# EAGLE design Controller (EAGLE 9.6.2)

## Sheet 1 of 6: Power Supply
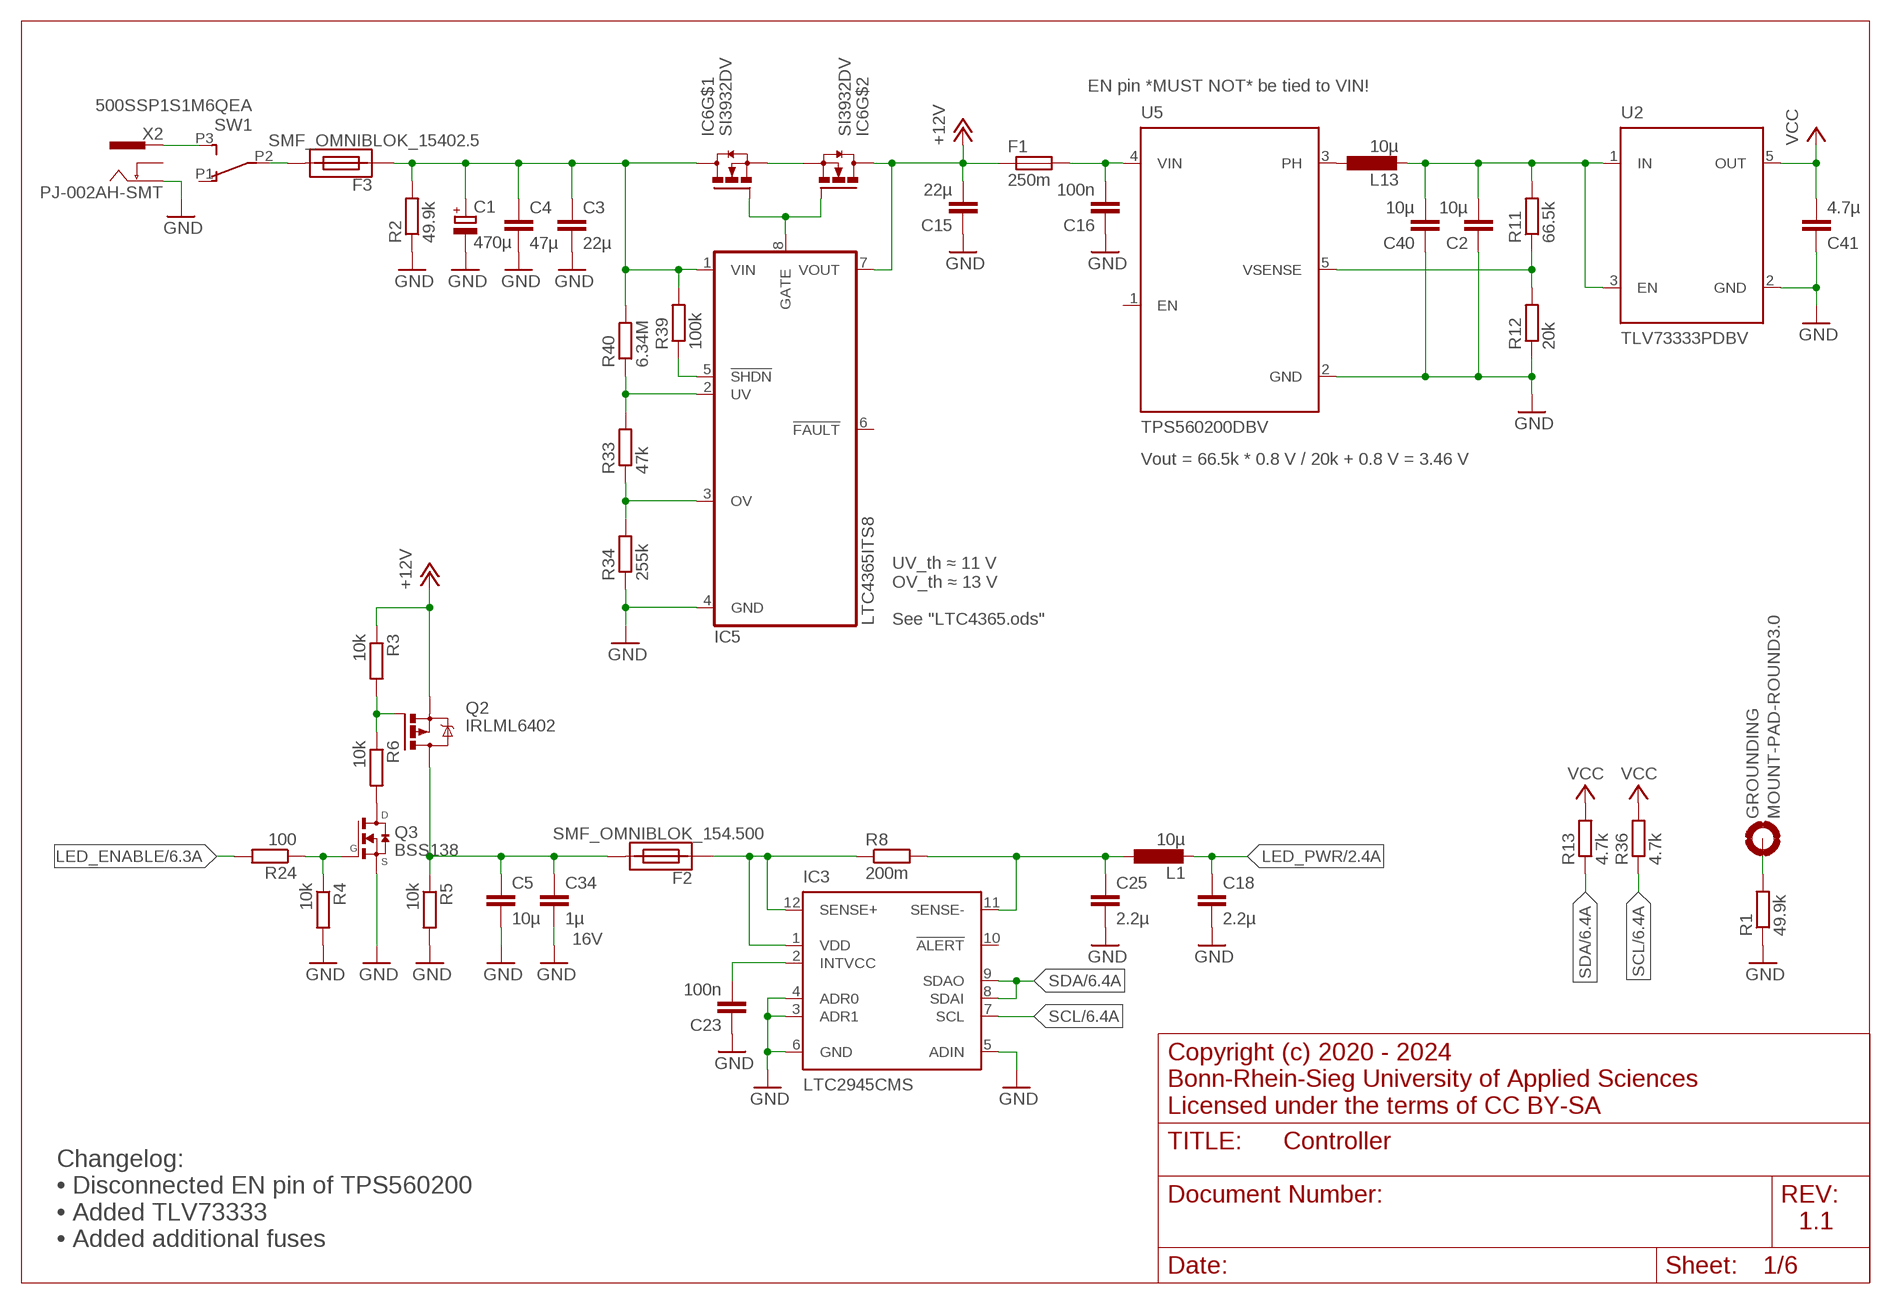
[diagram p0: schematic, sheet 1]

### Parts
C1  470µ  CPOL-EUUD-10X10  [UD-10X10_NICHICON]
C2  10µ  C-EUC0805  [C0805]
C3  22µ  C-EUC1206  [C1206]
C4  47µ  C-EUC1206  [C1206]
C5  10µ  C-EUC0805  [C0805]
C15  22µ  C-EUC0805  [C0805]
C16  100n  C-EUC0603  [C0603]
C18  2.2µ  C-EUC0805  [C0805]
C23  100n  C-EUC0603  [C0603]
C25  2.2µ  C-EUC0805  [C0805]
C34  1µ  C-EUC0805  [C0805]
C40  10µ  C-EUC0805  [C0805]
C41  4.7µ  C-EUC0805  [C0805]
F1  250m  FUSE0603  [R0603]
F2  SMF_OMNIBLOK_154.500  [NANO2_SMF_FUSEBLOCK]
F3  SMF_OMNIBLOK_15402.5  [NANO2_SMF_FUSEBLOCK]
GROUNDING  MOUNT-PAD-ROUND3.0  [3,0-PAD]
IC3  LTC2945CMS  [MSOP12]
IC5  LTC4365ITS8  [TSOT-23-8]
IC6  SI3932DV  [TSOT-23-6]
L1  10µ  LQH44PH100MPR  [SMD]
L13  10µ  VLS3012ET-100M  [2SMD]
Q2  IRLML6402  [MICRO3]
Q3  BSS138  [SOT23]
R1  49.9k  R-EU_R0805  [R0805]
R2  49.9k  R-EU_R1206  [R1206]
R3  10k  R-EU_R0603  [R0603]
R4  10k  R-EU_R0603  [R0603]
R5  10k  R-EU_R1206  [R1206]
R6  10k  R-EU_R0603  [R0603]
R8  200m  R-EU_R2512  [R2512]
R11  66.5k  R-EU_R0603  [R0603]
R12  20k  R-EU_R0603  [R0603]
R13  4.7k  R-EU_R0603  [R0603]
R24  100  R-EU_R0603  [R0603]
R33  47k  R-EU_R0603  [R0603]
R34  255k  R-EU_R0603  [R0603]
R36  4.7k  R-EU_R0603  [R0603]
R39  100k  R-EU_R0603  [R0603]
R40  6.34M  R-EU_R0603  [R0603]
SW1  500SSP1S1M6QEA  [500SSP1S1M6QEA]
U2  TLV73333PDBV  [SOT-23]
U5  TPS560200DBV  [SOT-23]
X2  PJ-002AH-SMT  [PJ-002AH-SMT]

### Nets
+12V [Power]: C15.2 F1.1 IC5.7(VOUT) IC6.4(D) Q2.2(S) R3.1 ; also sheet 6
GND: C1.- C2.1 C3.2 C4.2 C5.2 C15.1 C16.1 C18.2 C23.1 C25.2 C34.2 C40.1 C41.1 IC3.3(ADR1) IC3.4(ADR0) IC3.5(ADIN) IC3.6(GND) IC5.4(GND) Q3.2(S) R1.1 R2.1 R4.2 R5.2 R12.1 R34.1 U2.2(GND) U5.2(GND) X2.2(OUT) ; also sheet 2,3,4,5,6
LED_ENABLE: R24.2 ; also sheet 6
LED_PWR [Power]: C18.1 L1.2 ; also sheet 2,3,4,5,6
N$1: GROUNDING.B3,0(MOUNT) R1.2
N$2: C2.2 C40.2 L13.P$2 R11.2 U2.1(IN) U2.3(EN)
N$3: C25.1 IC3.11(SENSE-) L1.1 R8.2
N$4 [Power]: C16.2 F1.2 U5.4(VIN)
N$5: Q2.1(G) R3.2 R6.1
N$6: Q3.1(G) R4.1 R24.1
N$7: Q3.3(D) R6.2
N$8: C5.1 C34.1 F2.2 Q2.3(D) R5.1
N$11 [Power]: SW1.P3 X2.1-1(IN) X2.1-2(IN)
N$12: L13.P$1 U5.3(PH)
N$14 [Power]: C1.+ C3.1 C4.1 F3.1 IC5.1(VIN) IC6.6(D) R2.2 R39.2 R40.2
N$15: R11.1 R12.2 U5.5(VSENSE)
N$20: F2.1 IC3.1(VDD) IC3.12(SENSE+) R8.1
N$57: F3.2 SW1.P2
N$65: IC5.8(GATE) IC6.1(G) IC6.3(G)
N$66: IC5.3(OV) R33.1 R34.2
N$67: IC5.2(UV) R33.2 R40.1
N$68: IC5.5(!SHDN) R39.1
N$69: IC6.2(S) IC6.5(S)
N$72: C23.2 IC3.2(INTVCC)
SCL: IC3.7(SCL) R36.1 ; also sheet 6
SDA: IC3.8(SDAI) IC3.9(SDAO) R13.1 ; also sheet 6
VCC: C41.2 R13.2 R36.2 U2.5(OUT) ; also sheet 6
Unconnected: IC3.10(!ALERT!) IC5.6(!FAULT) SW1.P1 U5.1(EN) X2.3(CONTACT)

### Notes on the sheet
- EN pin *MUST NOT* be tied to VIN!
- Vout = 66.5k * 0.8 V / 20k + 0.8 V = 3.46 V
- UV_th ≈ 11 V
  OV_th ≈ 13 V
  
  See "LTC4365.ods"
- Copyright (c) 2020 - 2024
  Bonn-Rhein-Sieg University of Applied Sciences
  Licensed under the terms of CC BY-SA
- 1.1
- Changelog:
  • Disconnected EN pin of TPS560200
  • Added TLV73333
  • Added additional fuses

## Sheet 2 of 6: LED Drivers 1
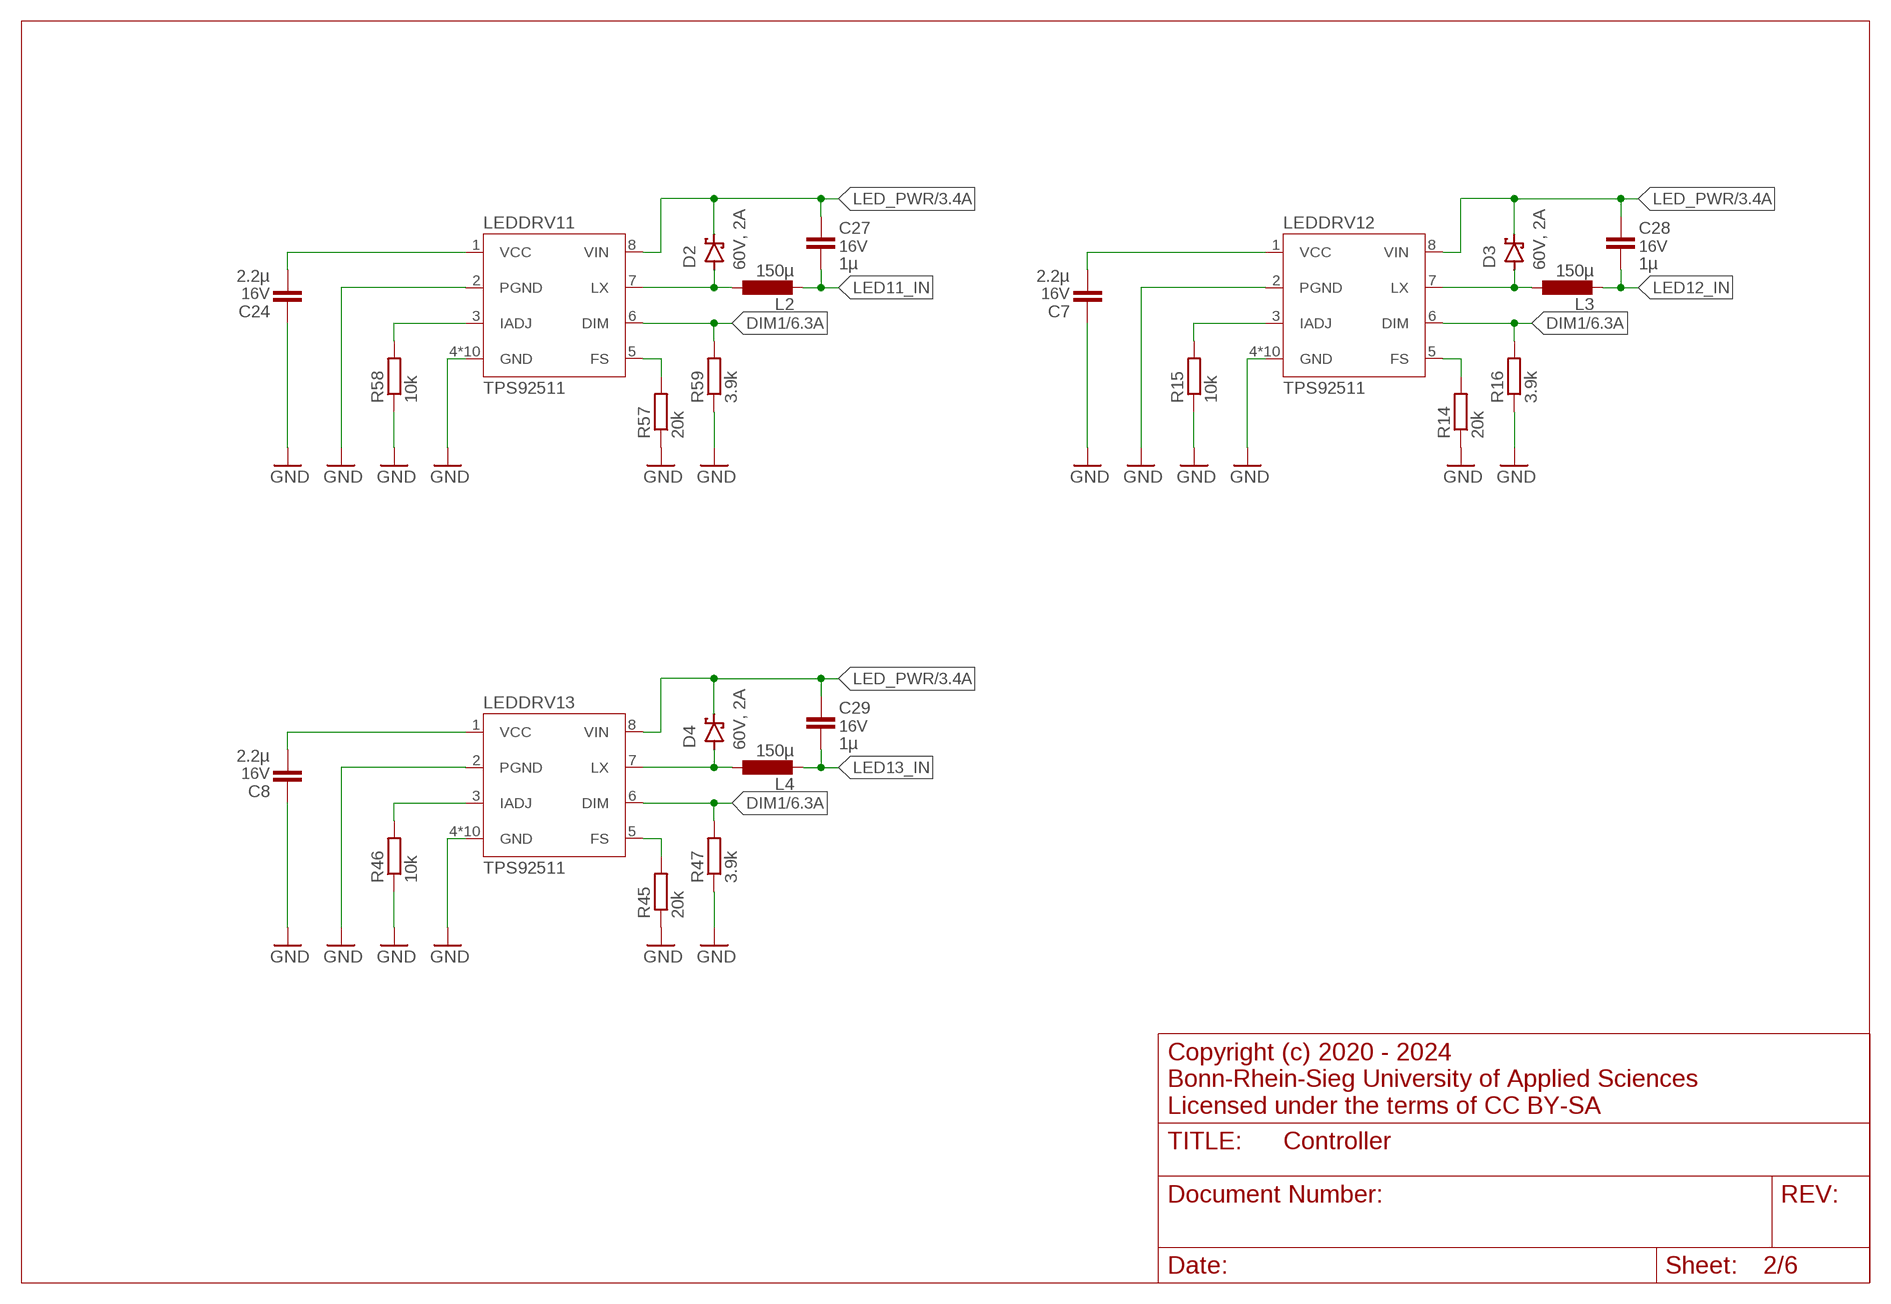
[diagram p1: schematic, sheet 2]

### Parts
C7  2.2µ  C-EUC0603  [C0603]
C8  2.2µ  C-EUC0603  [C0603]
C24  2.2µ  C-EUC0603  [C0603]
C27  1µ  C-EUC0805  [C0805]
C28  1µ  C-EUC0805  [C0805]
C29  1µ  C-EUC0805  [C0805]
D2  60V, 2A  SCHOTTKY-DIODESMD  [SMB]
D3  60V, 2A  SCHOTTKY-DIODESMD  [SMB]
D4  60V, 2A  SCHOTTKY-DIODESMD  [SMB]
L2  150µ  LQH44PH151MPR  [SMD]
L3  150µ  LQH44PH151MPR  [SMD]
L4  150µ  LQH44PH151MPR  [SMD]
LEDDRV11  TPS92511  [SOIC-8-EP]
LEDDRV12  TPS92511  [SOIC-8-EP]
LEDDRV13  TPS92511  [SOIC-8-EP]
R14  20k  R-EU_R0603  [R0603]
R15  10k  R-EU_R0603  [R0603]
R16  3.9k  R-EU_R0603  [R0603]
R45  20k  R-EU_R0603  [R0603]
R46  10k  R-EU_R0603  [R0603]
R47  3.9k  R-EU_R0603  [R0603]
R57  20k  R-EU_R0603  [R0603]
R58  10k  R-EU_R0603  [R0603]
R59  3.9k  R-EU_R0603  [R0603]

### Nets
DIM1: LEDDRV11.6(DIM) LEDDRV12.6(DIM) LEDDRV13.6(DIM) R16.2 R47.2 R59.2 ; also sheet 6
GND: C7.1 C8.1 C24.1 LEDDRV11.2(PGND) LEDDRV11.4(GND) LEDDRV11.EPAD(GND) LEDDRV11.P$1(GND) LEDDRV11.P$2(GND) LEDDRV11.P$3(GND) LEDDRV11.P$4(GND) LEDDRV11.P$5(GND) LEDDRV11.P$6(GND) LEDDRV11.P$7(GND) LEDDRV11.P$8(GND) LEDDRV12.2(PGND) LEDDRV12.4(GND) LEDDRV12.EPAD(GND) LEDDRV12.P$1(GND) LEDDRV12.P$2(GND) LEDDRV12.P$3(GND) LEDDRV12.P$4(GND) LEDDRV12.P$5(GND) LEDDRV12.P$6(GND) LEDDRV12.P$7(GND) LEDDRV12.P$8(GND) LEDDRV13.2(PGND) LEDDRV13.4(GND) LEDDRV13.EPAD(GND) LEDDRV13.P$1(GND) LEDDRV13.P$2(GND) LEDDRV13.P$3(GND) LEDDRV13.P$4(GND) LEDDRV13.P$5(GND) LEDDRV13.P$6(GND) LEDDRV13.P$7(GND) LEDDRV13.P$8(GND) R14.1 R15.1 R16.1 R45.1 R46.1 R47.1 R57.1 R58.1 R59.1 ; also sheet 1,3,4,5,6
LED11_IN: C27.2 L2.2 ; also sheet 6
LED12_IN: C28.2 L3.2 ; also sheet 6
LED13_IN: C29.2 L4.2 ; also sheet 6
LED_PWR [Power]: C27.1 C28.1 C29.1 D2.C D3.C D4.C LEDDRV11.8(VIN) LEDDRV12.8(VIN) LEDDRV13.8(VIN) ; also sheet 1,3,4,5,6
N$21: D3.A L3.1 LEDDRV12.7(LX)
N$22: LEDDRV12.5(FS) R14.2
N$23: LEDDRV12.3(IADJ) R15.2
N$24: C7.2 LEDDRV12.1(VCC)
N$25: D4.A L4.1 LEDDRV13.7(LX)
N$26: LEDDRV13.5(FS) R45.2
N$27: LEDDRV13.3(IADJ) R46.2
N$28: C8.2 LEDDRV13.1(VCC)
N$74: D2.A L2.1 LEDDRV11.7(LX)
N$75: LEDDRV11.5(FS) R57.2
N$76: LEDDRV11.3(IADJ) R58.2
N$77: C24.2 LEDDRV11.1(VCC)

### Notes on the sheet
- Copyright (c) 2020 - 2024
  Bonn-Rhein-Sieg University of Applied Sciences
  Licensed under the terms of CC BY-SA

## Sheet 3 of 6: LED Drivers 2
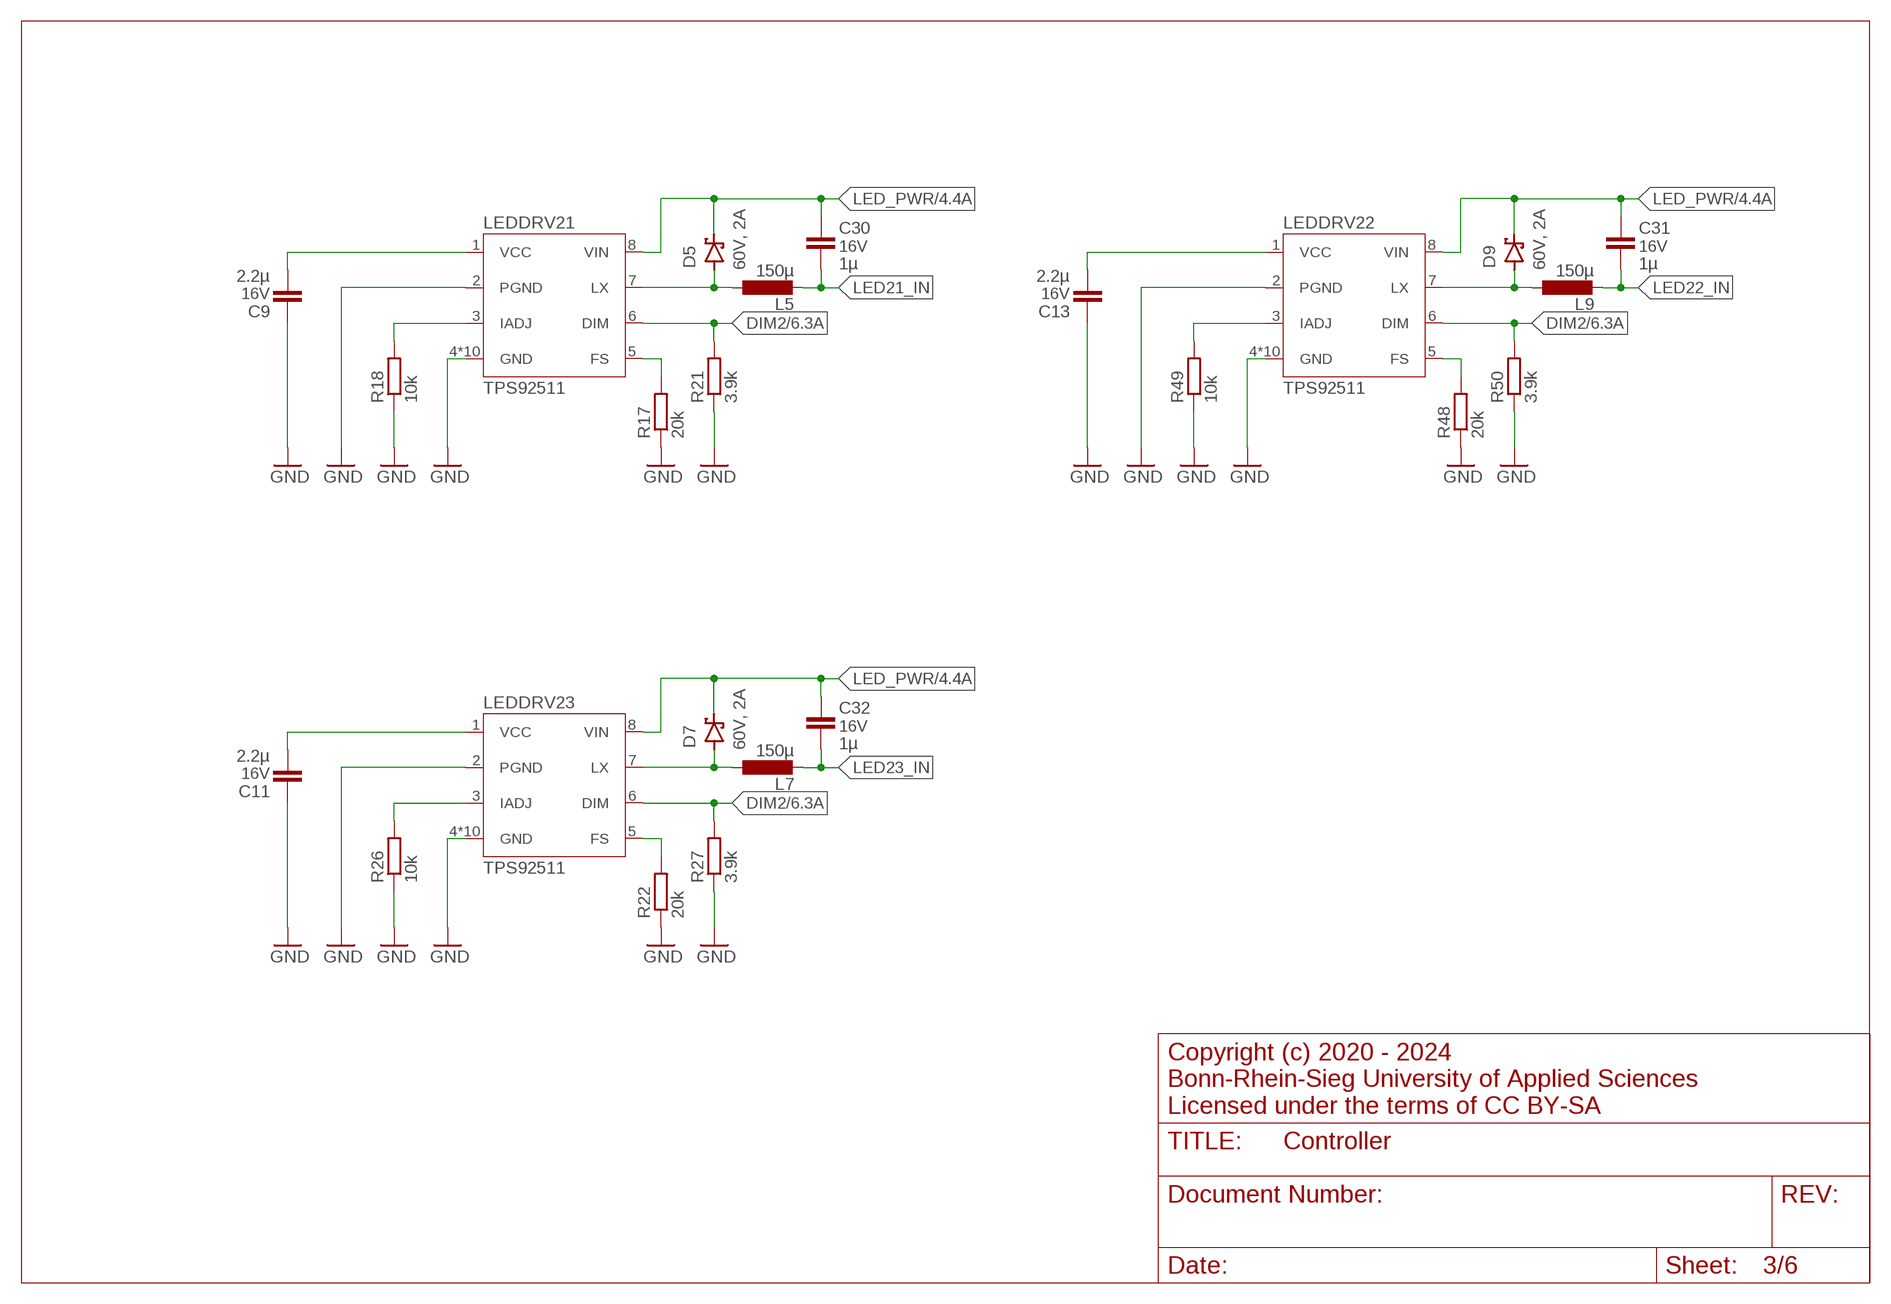
[diagram p2: schematic, sheet 3]

### Parts
C9  2.2µ  C-EUC0603  [C0603]
C11  2.2µ  C-EUC0603  [C0603]
C13  2.2µ  C-EUC0603  [C0603]
C30  1µ  C-EUC0805  [C0805]
C31  1µ  C-EUC0805  [C0805]
C32  1µ  C-EUC0805  [C0805]
D5  60V, 2A  SCHOTTKY-DIODESMD  [SMB]
D7  60V, 2A  SCHOTTKY-DIODESMD  [SMB]
D9  60V, 2A  SCHOTTKY-DIODESMD  [SMB]
L5  150µ  LQH44PH151MPR  [SMD]
L7  150µ  LQH44PH151MPR  [SMD]
L9  150µ  LQH44PH151MPR  [SMD]
LEDDRV21  TPS92511  [SOIC-8-EP]
LEDDRV22  TPS92511  [SOIC-8-EP]
LEDDRV23  TPS92511  [SOIC-8-EP]
R17  20k  R-EU_R0603  [R0603]
R18  10k  R-EU_R0603  [R0603]
R21  3.9k  R-EU_R0603  [R0603]
R22  20k  R-EU_R0603  [R0603]
R26  10k  R-EU_R0603  [R0603]
R27  3.9k  R-EU_R0603  [R0603]
R48  20k  R-EU_R0603  [R0603]
R49  10k  R-EU_R0603  [R0603]
R50  3.9k  R-EU_R0603  [R0603]

### Nets
DIM2: LEDDRV21.6(DIM) LEDDRV22.6(DIM) LEDDRV23.6(DIM) R21.2 R27.2 R50.2 ; also sheet 6
GND: C9.1 C11.1 C13.1 LEDDRV21.2(PGND) LEDDRV21.4(GND) LEDDRV21.EPAD(GND) LEDDRV21.P$1(GND) LEDDRV21.P$2(GND) LEDDRV21.P$3(GND) LEDDRV21.P$4(GND) LEDDRV21.P$5(GND) LEDDRV21.P$6(GND) LEDDRV21.P$7(GND) LEDDRV21.P$8(GND) LEDDRV22.2(PGND) LEDDRV22.4(GND) LEDDRV22.EPAD(GND) LEDDRV22.P$1(GND) LEDDRV22.P$2(GND) LEDDRV22.P$3(GND) LEDDRV22.P$4(GND) LEDDRV22.P$5(GND) LEDDRV22.P$6(GND) LEDDRV22.P$7(GND) LEDDRV22.P$8(GND) LEDDRV23.2(PGND) LEDDRV23.4(GND) LEDDRV23.EPAD(GND) LEDDRV23.P$1(GND) LEDDRV23.P$2(GND) LEDDRV23.P$3(GND) LEDDRV23.P$4(GND) LEDDRV23.P$5(GND) LEDDRV23.P$6(GND) LEDDRV23.P$7(GND) LEDDRV23.P$8(GND) R17.1 R18.1 R21.1 R22.1 R26.1 R27.1 R48.1 R49.1 R50.1 ; also sheet 1,2,4,5,6
LED21_IN: C30.2 L5.2 ; also sheet 6
LED22_IN: C31.2 L9.2 ; also sheet 6
LED23_IN: C32.2 L7.2 ; also sheet 6
LED_PWR [Power]: C30.1 C31.1 C32.1 D5.C D7.C D9.C LEDDRV21.8(VIN) LEDDRV22.8(VIN) LEDDRV23.8(VIN) ; also sheet 1,2,4,5,6
N$29: D5.A L5.1 LEDDRV21.7(LX)
N$30: LEDDRV21.5(FS) R17.2
N$31: LEDDRV21.3(IADJ) R18.2
N$32: C9.2 LEDDRV21.1(VCC)
N$37: D7.A L7.1 LEDDRV23.7(LX)
N$38: LEDDRV23.5(FS) R22.2
N$39: LEDDRV23.3(IADJ) R26.2
N$40: C11.2 LEDDRV23.1(VCC)
N$45: D9.A L9.1 LEDDRV22.7(LX)
N$46: LEDDRV22.5(FS) R48.2
N$47: LEDDRV22.3(IADJ) R49.2
N$48: C13.2 LEDDRV22.1(VCC)

### Notes on the sheet
- Copyright (c) 2020 - 2024
  Bonn-Rhein-Sieg University of Applied Sciences
  Licensed under the terms of CC BY-SA

## Sheet 4 of 6: LED Drivers 3
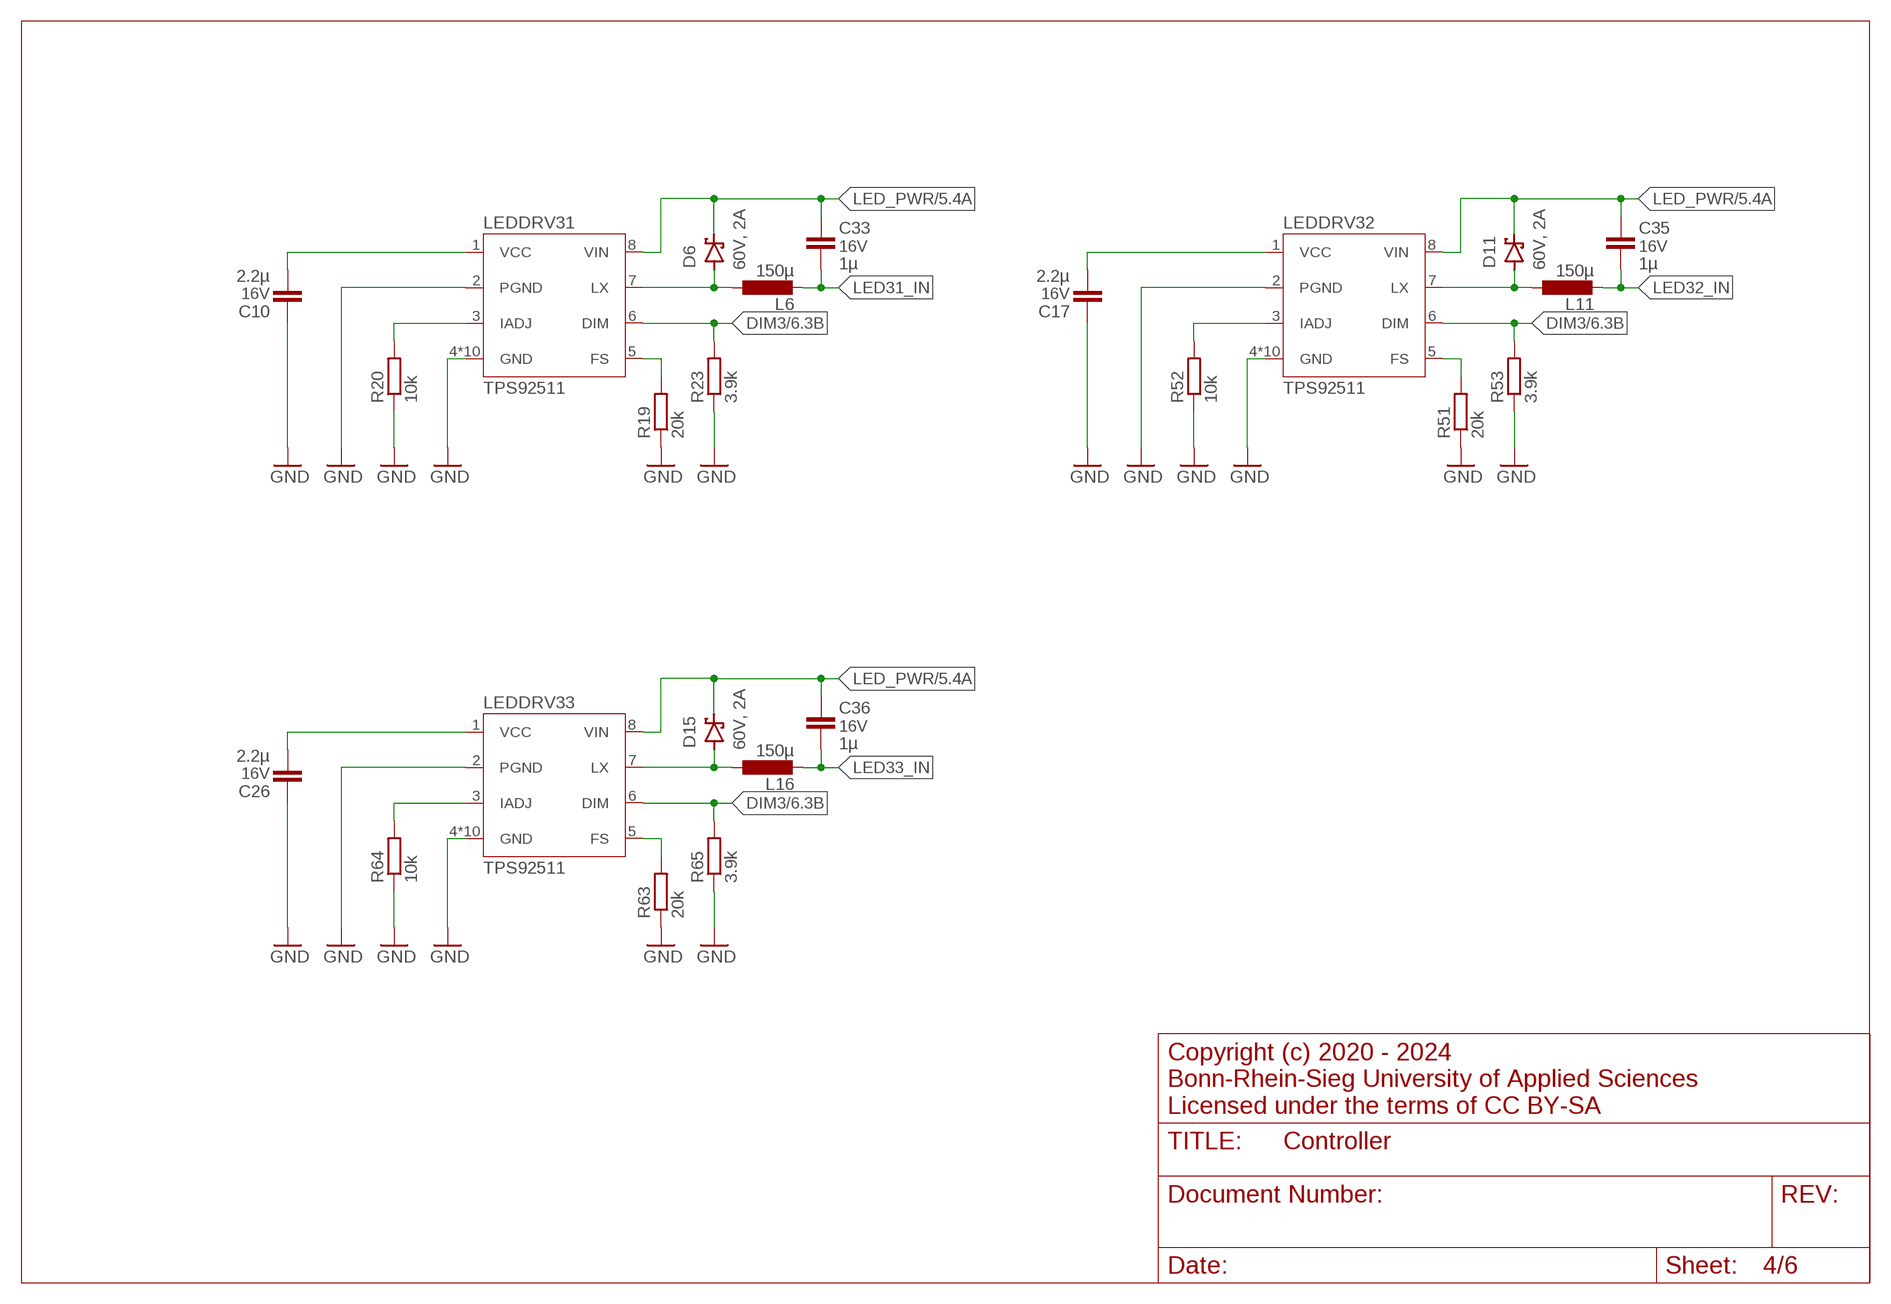
[diagram p3: schematic, sheet 4]

### Parts
C10  2.2µ  C-EUC0603  [C0603]
C17  2.2µ  C-EUC0603  [C0603]
C26  2.2µ  C-EUC0603  [C0603]
C33  1µ  C-EUC0805  [C0805]
C35  1µ  C-EUC0805  [C0805]
C36  1µ  C-EUC0805  [C0805]
D6  60V, 2A  SCHOTTKY-DIODESMD  [SMB]
D11  60V, 2A  SCHOTTKY-DIODESMD  [SMB]
D15  60V, 2A  SCHOTTKY-DIODESMD  [SMB]
L6  150µ  LQH44PH151MPR  [SMD]
L11  150µ  LQH44PH151MPR  [SMD]
L16  150µ  LQH44PH151MPR  [SMD]
LEDDRV31  TPS92511  [SOIC-8-EP]
LEDDRV32  TPS92511  [SOIC-8-EP]
LEDDRV33  TPS92511  [SOIC-8-EP]
R19  20k  R-EU_R0603  [R0603]
R20  10k  R-EU_R0603  [R0603]
R23  3.9k  R-EU_R0603  [R0603]
R51  20k  R-EU_R0603  [R0603]
R52  10k  R-EU_R0603  [R0603]
R53  3.9k  R-EU_R0603  [R0603]
R63  20k  R-EU_R0603  [R0603]
R64  10k  R-EU_R0603  [R0603]
R65  3.9k  R-EU_R0603  [R0603]

### Nets
DIM3: LEDDRV31.6(DIM) LEDDRV32.6(DIM) LEDDRV33.6(DIM) R23.2 R53.2 R65.2 ; also sheet 6
GND: C10.1 C17.1 C26.1 LEDDRV31.2(PGND) LEDDRV31.4(GND) LEDDRV31.EPAD(GND) LEDDRV31.P$1(GND) LEDDRV31.P$2(GND) LEDDRV31.P$3(GND) LEDDRV31.P$4(GND) LEDDRV31.P$5(GND) LEDDRV31.P$6(GND) LEDDRV31.P$7(GND) LEDDRV31.P$8(GND) LEDDRV32.2(PGND) LEDDRV32.4(GND) LEDDRV32.EPAD(GND) LEDDRV32.P$1(GND) LEDDRV32.P$2(GND) LEDDRV32.P$3(GND) LEDDRV32.P$4(GND) LEDDRV32.P$5(GND) LEDDRV32.P$6(GND) LEDDRV32.P$7(GND) LEDDRV32.P$8(GND) LEDDRV33.2(PGND) LEDDRV33.4(GND) LEDDRV33.EPAD(GND) LEDDRV33.P$1(GND) LEDDRV33.P$2(GND) LEDDRV33.P$3(GND) LEDDRV33.P$4(GND) LEDDRV33.P$5(GND) LEDDRV33.P$6(GND) LEDDRV33.P$7(GND) LEDDRV33.P$8(GND) R19.1 R20.1 R23.1 R51.1 R52.1 R53.1 R63.1 R64.1 R65.1 ; also sheet 1,2,3,5,6
LED31_IN: C33.2 L6.2 ; also sheet 6
LED32_IN: C35.2 L11.2 ; also sheet 6
LED33_IN: C36.2 L16.2 ; also sheet 6
LED_PWR [Power]: C33.1 C35.1 C36.1 D6.C D11.C D15.C LEDDRV31.8(VIN) LEDDRV32.8(VIN) LEDDRV33.8(VIN) ; also sheet 1,2,3,5,6
N$33: D6.A L6.1 LEDDRV31.7(LX)
N$34: LEDDRV31.5(FS) R19.2
N$35: LEDDRV31.3(IADJ) R20.2
N$36: C10.2 LEDDRV31.1(VCC)
N$53: D11.A L11.1 LEDDRV32.7(LX)
N$54: LEDDRV32.5(FS) R51.2
N$55: LEDDRV32.3(IADJ) R52.2
N$56: C17.2 LEDDRV32.1(VCC)
N$82: D15.A L16.1 LEDDRV33.7(LX)
N$83: LEDDRV33.5(FS) R63.2
N$84: LEDDRV33.3(IADJ) R64.2
N$85: C26.2 LEDDRV33.1(VCC)

### Notes on the sheet
- Copyright (c) 2020 - 2024
  Bonn-Rhein-Sieg University of Applied Sciences
  Licensed under the terms of CC BY-SA

## Sheet 5 of 6: LED Drivers 4
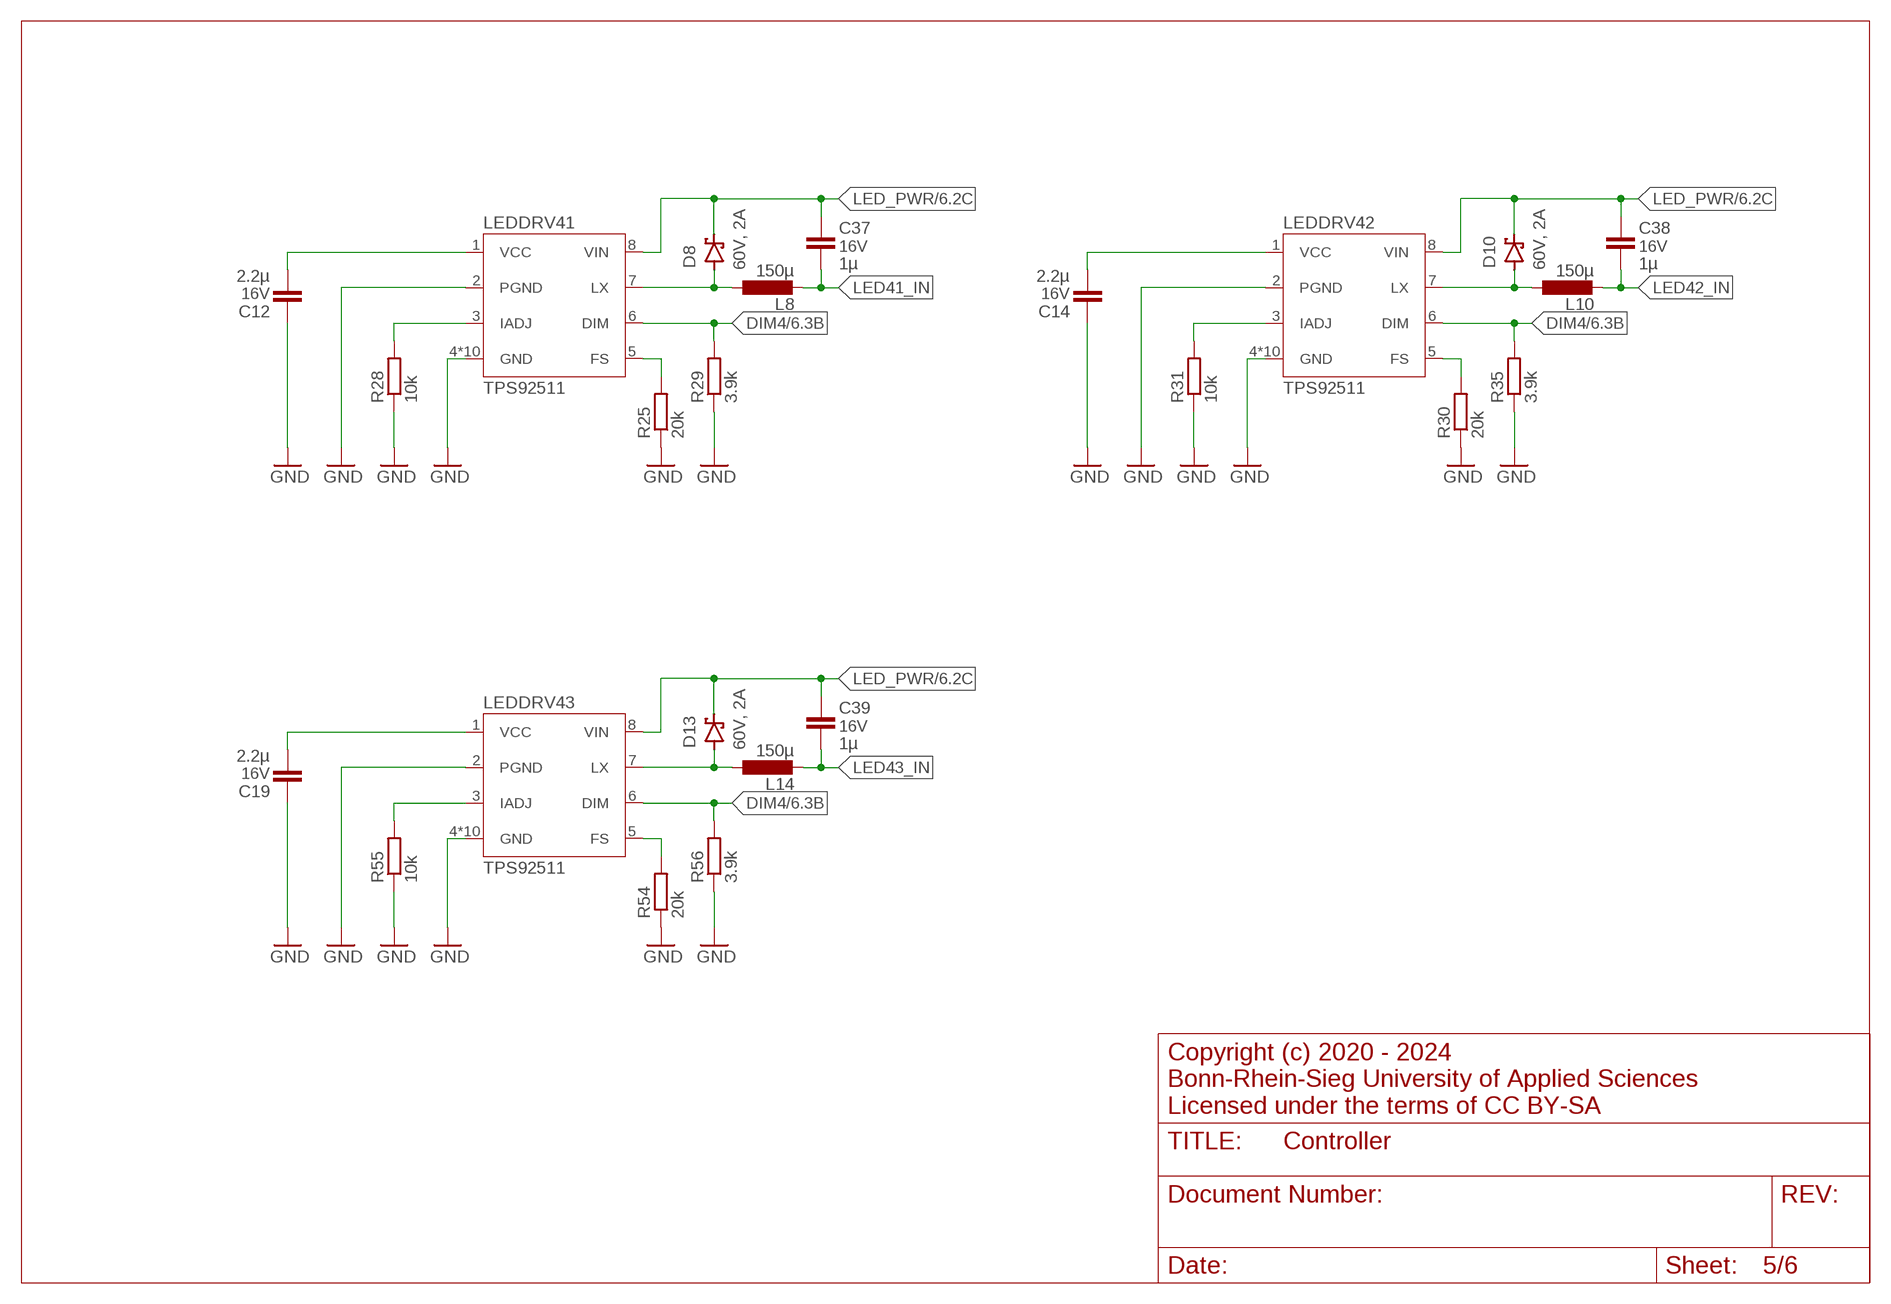
[diagram p4: schematic, sheet 5]

### Parts
C12  2.2µ  C-EUC0603  [C0603]
C14  2.2µ  C-EUC0603  [C0603]
C19  2.2µ  C-EUC0603  [C0603]
C37  1µ  C-EUC0805  [C0805]
C38  1µ  C-EUC0805  [C0805]
C39  1µ  C-EUC0805  [C0805]
D8  60V, 2A  SCHOTTKY-DIODESMD  [SMB]
D10  60V, 2A  SCHOTTKY-DIODESMD  [SMB]
D13  60V, 2A  SCHOTTKY-DIODESMD  [SMB]
L8  150µ  LQH44PH151MPR  [SMD]
L10  150µ  LQH44PH151MPR  [SMD]
L14  150µ  LQH44PH151MPR  [SMD]
LEDDRV41  TPS92511  [SOIC-8-EP]
LEDDRV42  TPS92511  [SOIC-8-EP]
LEDDRV43  TPS92511  [SOIC-8-EP]
R25  20k  R-EU_R0603  [R0603]
R28  10k  R-EU_R0603  [R0603]
R29  3.9k  R-EU_R0603  [R0603]
R30  20k  R-EU_R0603  [R0603]
R31  10k  R-EU_R0603  [R0603]
R35  3.9k  R-EU_R0603  [R0603]
R54  20k  R-EU_R0603  [R0603]
R55  10k  R-EU_R0603  [R0603]
R56  3.9k  R-EU_R0603  [R0603]

### Nets
DIM4: LEDDRV41.6(DIM) LEDDRV42.6(DIM) LEDDRV43.6(DIM) R29.2 R35.2 R56.2 ; also sheet 6
GND: C12.1 C14.1 C19.1 LEDDRV41.2(PGND) LEDDRV41.4(GND) LEDDRV41.EPAD(GND) LEDDRV41.P$1(GND) LEDDRV41.P$2(GND) LEDDRV41.P$3(GND) LEDDRV41.P$4(GND) LEDDRV41.P$5(GND) LEDDRV41.P$6(GND) LEDDRV41.P$7(GND) LEDDRV41.P$8(GND) LEDDRV42.2(PGND) LEDDRV42.4(GND) LEDDRV42.EPAD(GND) LEDDRV42.P$1(GND) LEDDRV42.P$2(GND) LEDDRV42.P$3(GND) LEDDRV42.P$4(GND) LEDDRV42.P$5(GND) LEDDRV42.P$6(GND) LEDDRV42.P$7(GND) LEDDRV42.P$8(GND) LEDDRV43.2(PGND) LEDDRV43.4(GND) LEDDRV43.EPAD(GND) LEDDRV43.P$1(GND) LEDDRV43.P$2(GND) LEDDRV43.P$3(GND) LEDDRV43.P$4(GND) LEDDRV43.P$5(GND) LEDDRV43.P$6(GND) LEDDRV43.P$7(GND) LEDDRV43.P$8(GND) R25.1 R28.1 R29.1 R30.1 R31.1 R35.1 R54.1 R55.1 R56.1 ; also sheet 1,2,3,4,6
LED41_IN: C37.2 L8.2 ; also sheet 6
LED42_IN: C38.2 L10.2 ; also sheet 6
LED43_IN: C39.2 L14.2 ; also sheet 6
LED_PWR [Power]: C37.1 C38.1 C39.1 D8.C D10.C D13.C LEDDRV41.8(VIN) LEDDRV42.8(VIN) LEDDRV43.8(VIN) ; also sheet 1,2,3,4,6
N$41: D8.A L8.1 LEDDRV41.7(LX)
N$42: LEDDRV41.5(FS) R25.2
N$43: LEDDRV41.3(IADJ) R28.2
N$44: C12.2 LEDDRV41.1(VCC)
N$49: D10.A L10.1 LEDDRV42.7(LX)
N$50: LEDDRV42.5(FS) R30.2
N$51: LEDDRV42.3(IADJ) R31.2
N$52: C14.2 LEDDRV42.1(VCC)
N$61: D13.A L14.1 LEDDRV43.7(LX)
N$62: LEDDRV43.5(FS) R54.2
N$63: LEDDRV43.3(IADJ) R55.2
N$64: C19.2 LEDDRV43.1(VCC)

### Notes on the sheet
- Copyright (c) 2020 - 2024
  Bonn-Rhein-Sieg University of Applied Sciences
  Licensed under the terms of CC BY-SA

## Sheet 6 of 6: µController & Connectors
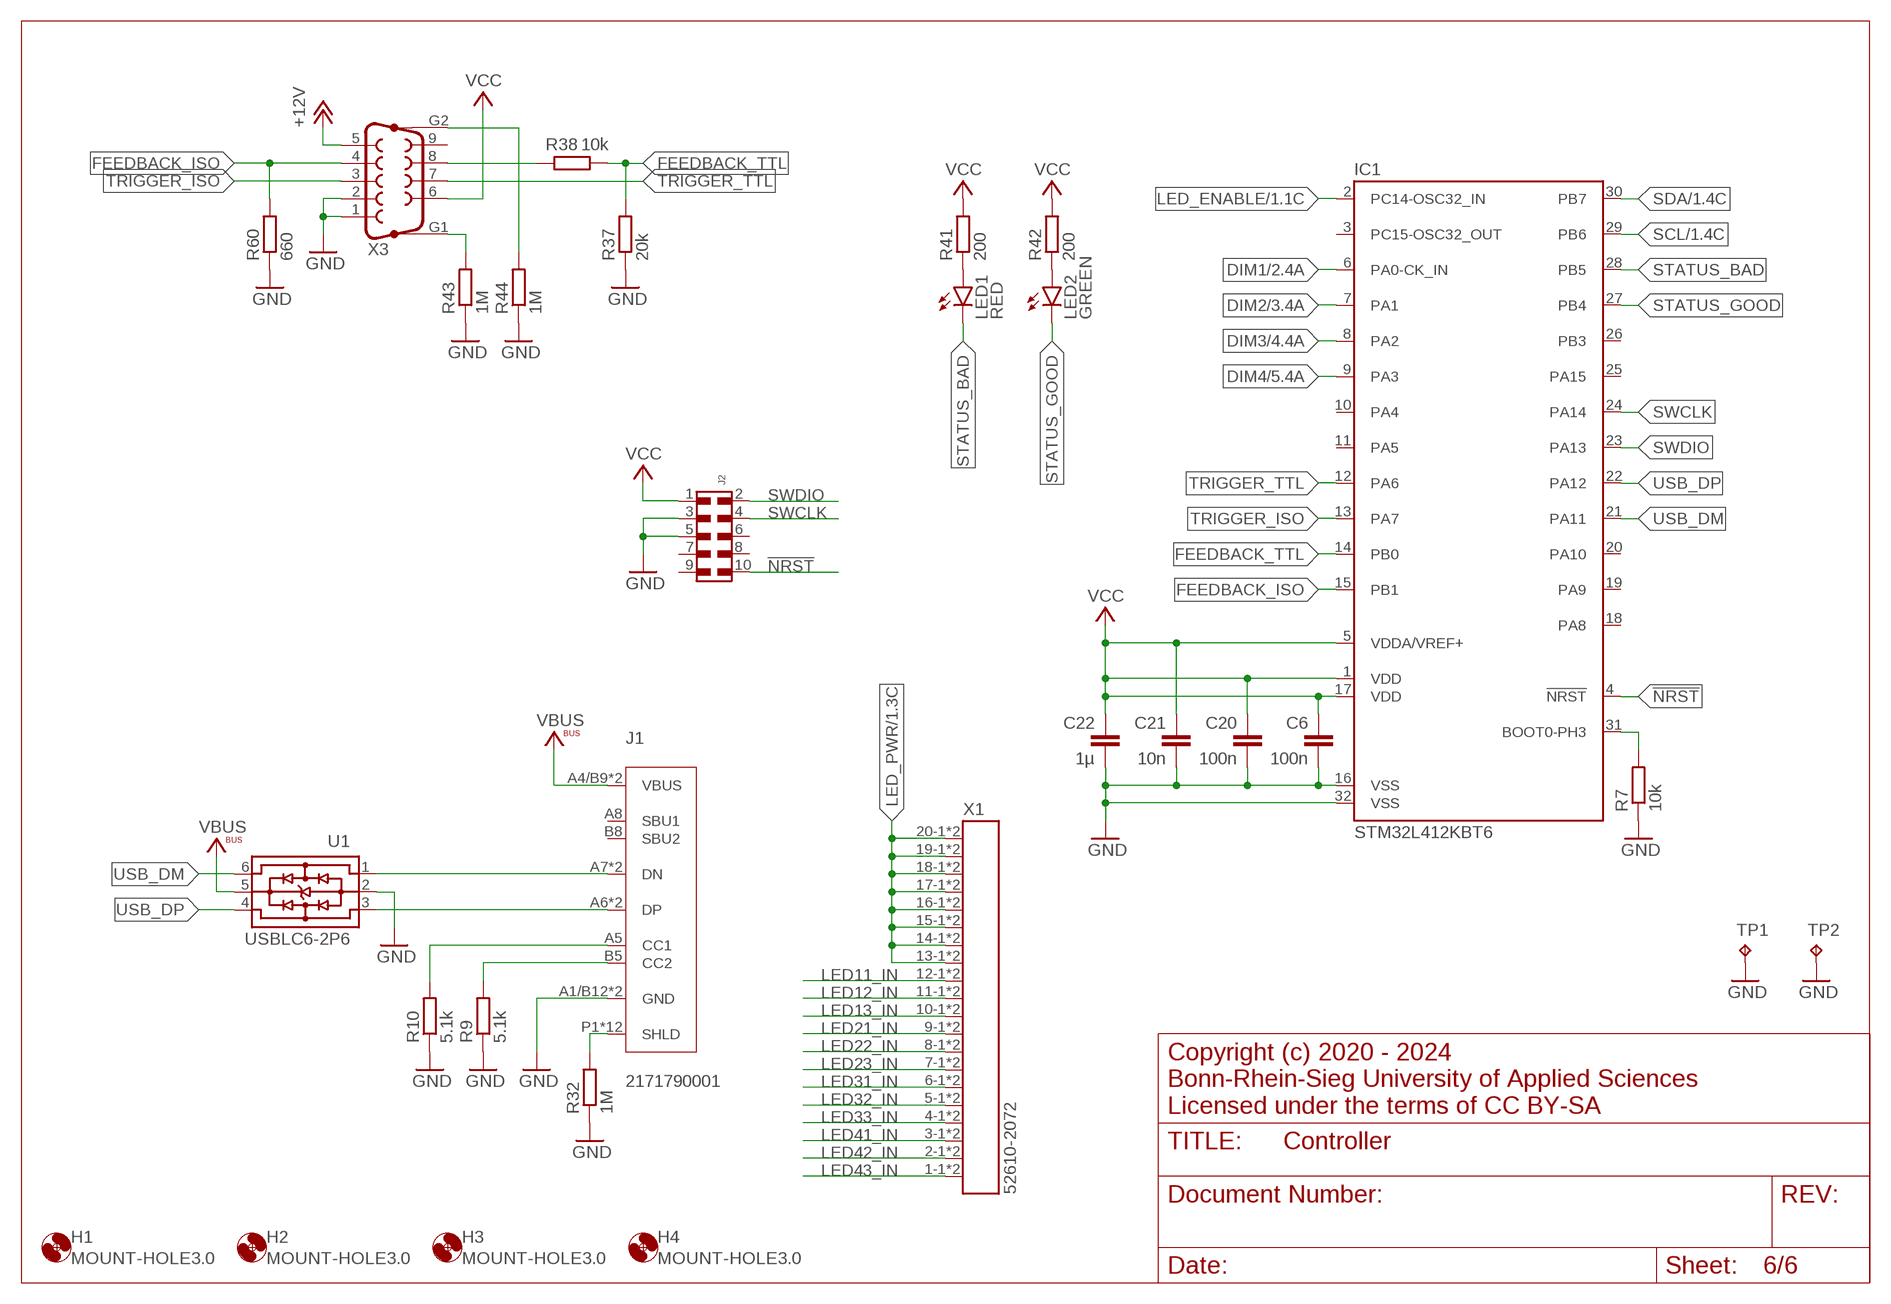
[diagram p5: schematic, sheet 6]

### Parts
C6  100n  C-EUC0603  [C0603]
C20  100n  C-EUC0603  [C0603]
C21  10n  C-EUC0603  [C0603]
C22  1µ  C-EUC0603  [C0603]
H1  MOUNT-HOLE3.0  [3,0]
H2  MOUNT-HOLE3.0  [3,0]
H3  MOUNT-HOLE3.0  [3,0]
H4  MOUNT-HOLE3.0  [3,0]
IC1  STM32L412KBT6  [LQFP32]
J1  2171790001  [2171790001_MOL]
J2  6210XX21021_62101021021  [62101021021]
LED1  RED  LED3MM  [LED3MM]
LED2  GREEN  LED3MM  [LED3MM]
R7  10k  R-EU_R0603  [R0603]
R9  5.1k  R-EU_R0603  [R0603]
R10  5.1k  R-EU_R0603  [R0603]
R32  1M  R-EU_R0603  [R0603]
R37  20k  R-EU_R0603  [R0603]
R38  10k  R-EU_R0603  [R0603]
R41  200  R-EU_R0603  [R0603]
R42  200  R-EU_R0603  [R0603]
R43  1M  R-EU_R0603  [R0603]
R44  1M  R-EU_R0603  [R0603]
R60  660  R-EU_R0603  [R0603]
TP1  TP3.8X2.03  [3.8X2.03]
TP2  TP3.8X2.03  [3.8X2.03]
U1  USBLC6-2P6  [SOT-666]
X1  52610-2072  [52610-2072]
X3  F09HP  [F09HP]

### Nets
!NRST: IC1.4(!NRST) J2.10
+12V [Power]: X3.5 ; also sheet 1
DIM1: IC1.6(PA0-CK_IN) ; also sheet 2
DIM2: IC1.7(PA1) ; also sheet 3
DIM3: IC1.8(PA2) ; also sheet 4
DIM4: IC1.9(PA3) ; also sheet 5
FEEDBACK_ISO: IC1.15(PB1) R60.2 X3.4
FEEDBACK_TTL: IC1.14(PB0) R37.2 R38.1
GND: C6.2 C20.2 C21.2 C22.2 IC1.16(VSS) IC1.32(VSS) J1.A1/B12(GND) J1.B1/A12(GND) J2.3 J2.5 R7.1 R9.1 R10.1 R32.1 R37.1 R43.1 R44.1 R60.1 TP1.TP TP2.TP U1.2 X3.1 X3.2 ; also sheet 1,2,3,4,5
LED11_IN: X1.12-1 X1.12-2 ; also sheet 2
LED12_IN: X1.11-1 X1.11-2 ; also sheet 2
LED13_IN: X1.10-1 X1.10-2 ; also sheet 2
LED21_IN: X1.9-1 X1.9-2 ; also sheet 3
LED22_IN: X1.8-1 X1.8-2 ; also sheet 3
LED23_IN: X1.7-1 X1.7-2 ; also sheet 3
LED31_IN: X1.6-1 X1.6-2 ; also sheet 4
LED32_IN: X1.5-1 X1.5-2 ; also sheet 4
LED33_IN: X1.4-1 X1.4-2 ; also sheet 4
LED41_IN: X1.3-1 X1.3-2 ; also sheet 5
LED42_IN: X1.2-1 X1.2-2 ; also sheet 5
LED43_IN: X1.1-1 X1.1-2 ; also sheet 5
LED_ENABLE: IC1.2(PC14-OSC32_IN) ; also sheet 1
LED_PWR [Power]: X1.13-1 X1.13-2 X1.14-1 X1.14-2 X1.15-1 X1.15-2 X1.16-1 X1.16-2 X1.17-1 X1.17-2 X1.18-1 X1.18-2 X1.19-1 X1.19-2 X1.20-1 X1.20-2 ; also sheet 1,2,3,4,5
N$9: IC1.31(BOOT0-PH3) R7.2
N$10: R43.2 X3.G1
N$13: J1.A7(DN) J1.B7(DN) U1.1
N$16: J1.A6(DP) J1.B6(DP) U1.3
N$17: J1.B5(CC2) R9.2
N$18: J1.A5(CC1) R10.2
N$19: J1.P1(SHLD) J1.P2(SHLD) J1.P3(SHLD) J1.P4(SHLD) J1.S1(SHLD) J1.S2(SHLD) J1.S3(SHLD) J1.S4(SHLD) J1.S5(SHLD) J1.S6(SHLD) J1.S7(SHLD) J1.S8(SHLD) R32.2
N$58: R38.2 X3.8
N$70: LED1.A R41.1
N$71: LED2.A R42.1
N$73: R44.2 X3.G2
SCL: IC1.29(PB6) ; also sheet 1
SDA: IC1.30(PB7) ; also sheet 1
STATUS_BAD: IC1.28(PB5) LED1.K(C)
STATUS_GOOD: IC1.27(PB4) LED2.K(C)
SWCLK: IC1.24(PA14) J2.4
SWDIO: IC1.23(PA13) J2.2
TRIGGER_ISO: IC1.13(PA7) X3.3
TRIGGER_TTL: IC1.12(PA6) X3.7
USB_DM: IC1.21(PA11) U1.6
USB_DP: IC1.22(PA12) U1.4
VBUS: J1.A4/B9(VBUS) J1.B4/A9(VBUS) U1.5
VCC: C6.1 C20.1 C21.1 C22.1 IC1.1(VDD) IC1.5(VDDA/VREF+) IC1.17(VDD) J2.1 R41.2 R42.2 X3.6 ; also sheet 1
Unconnected: IC1.3(PC15-OSC32_OUT) IC1.10(PA4) IC1.11(PA5) IC1.18(PA8) IC1.19(PA9) IC1.20(PA10) IC1.25(PA15) IC1.26(PB3) J1.A8(SBU1) J1.B8(SBU2) J2.6 J2.7 J2.8 J2.9 X3.9

### Notes on the sheet
- Copyright (c) 2020 - 2024
  Bonn-Rhein-Sieg University of Applied Sciences
  Licensed under the terms of CC BY-SA

## Library data of the parts
C1 = rcl:CPOL-EU: POLARIZED CAPACITOR, European symbol; SPICEPREFIX: C
C2 C5 C15 C16 C18 C23 C25 C40 C41 = rcl:C-EU: CAPACITOR, European symbol
C3 C4 C6 C20-C22 = rcl:C-EU: CAPACITOR, European symbol; SPICEPREFIX: C
C7-C14 C17 C19 C24 C26-C33 C35-C39 = rcl:C-EU: CAPACITOR, European symbol; RATING: 16V; SPICEPREFIX: C
C34 = rcl:C-EU: CAPACITOR, European symbol; RATING: 16V
D2-D11 D13 D15 = diode:SCHOTTKY-DIODE: Schottky Diode; FBS_ID: 1101
F1 = Fuse0603:FUSE: Surface mount fuse
F2 = Littelfuse:SMF_OMNIBLOK_154: Littlefuse SMF OMNI-BLOK (R) Fuse Holder with Installed Fuse (NANO2 SMF): Series 154; FBS_ID: 963
F3 = Littelfuse:SMF_OMNIBLOK_154: Littlefuse SMF OMNI-BLOK (R) Fuse Holder with Installed Fuse (NANO2 SMF): Series 154
GROUNDING = holes:MOUNT-PAD-ROUND: MOUNTING PAD, round
H1-H4 = holes:MOUNT-HOLE: MOUNTING HOLE with drill center marker
IC1 = STM32:STM32L412K*?: Ultra-low-power ARM Cortex-M4 32-bit MCU+FPU, 100DMIPS, up to 128KB Flash, 40KB SRAM, analog, ext. SMPS
IC3 = LTC2945:LTC2945: Wide Range I2C Power Monitor
IC5 = LTC4365:LTC4365: UV, OV and Reverse Supply Protection Controller
IC6 = Si3932:SI3932DV: Dual N-Channel 30 V (D-S) MOSFET
J1 = USB-C:2171790001; COPYRIGHT: Copyright (C) 2021 Ultra Librarian. All rights reserved.; DIGI-KEY_PART_NUMBER_1: 900-2171790001TR-ND; DIGI-KEY_PART_NUMBER_2: 900-2171790001CT-ND; DIGI-KEY_PART_NUMBER_3: 900-2171790001DKR-ND; MANUFACTURER_PART_NUMBER: 2171790001; MFR_NAME: Molex Connector Corporation
J2 = WR-PHD:6210XX21021_62101021021: WR-PHD 1.27 mm SMT Dual Pin Header, H=3.80 mm ARTICLE PROPERTIES: Pins:4;​ 8;​ 10;​ 14;​ 16;​ 20;​ 28;​ 40;​ 44;​ 50 KIND PROPERTIES: Pitch：1.27 mm Quality Class:3 as per CECC 75 301-802 Rows：Dual Gender：Pin Header Type：Straight MATERIAL PROPERTIES: Insulator Material :PA9T Insulator Flammability Rating:UL94 V-0 Contact Material:Copper Alloy Contact Plating:Gold Contact Type:Stamped GENERAL INFORMATION Operating Temperature:-40 up to +105 °C Compliance:Lead free / RoHS ELECTRICAL PROPERTIES: Rated Current:1 A;​ max. IR1:1 A Withstanding Voltage:500 V (AC) Contact Resistance:20 mΩ RISO:1000 MΩ CERTIFICATION UL Approval:E323964 PACKAGING PROPERTIES Packaging:Tube Packaging Unit:228;​ 114;​ 91;​ 65;​ 57;​ 45;​ 32;​ 23;​ 20;​ 18 <https://katalog.we-online.com/media/images/v2/o33195v209%20Family_WR-PDH_621xxx21021.jpg> Details see: https://katalog.we-online.com/en/em/PHD_1_27_SMT_DUAL_PIN_HEADER_6210XX21021 Updated by Yingchun,Shan 2019-10-25 2019 (C) Würth Elektronik; DATASHEET-URL: https://katalog.we-online.com/em/datasheet/62101021021.pdf; GENDER: Pin Header; IR: 1A; MATES: WR-PHD 1.27mm Dual Socket Header/SMT Dual Socket Header,H=4.5mm/SMT Dual Socket Header,H=4.5mm(Reel); PACKAGING: Tube; PART-NUMBER: 62101021021; PINS: 10; ROWS: Dual; TYPE: Straight
L1-L11 L14 L16 = LQH44PH:LQH44PH: Chip Coils/Inductors
L13 = VLS3012E:VLS3012E?-*: Inductors for power circuits
LED1 LED2 = led:LED: LED OSRAM: - CHIPLED LG R971, LG N971, LY N971, LG Q971, LY Q971, LO R971, LY R971 LH N974, LH R974 LS Q976, LO Q976, LY Q976 LO Q996 - Hyper CHIPLED LW Q18S LB Q993, LB Q99A, LB R99A - SideLED LS A670, LO A670, LY A670, LG A670, LP A670 LB A673, LV A673, LT A673, LW A673 LH A674 LY A675 LS A676, LA A676, LO A676, LY A676, LW A676 LS A679, LY A679, LG A679 - Hyper Micro SIDELED® LS Y876, LA Y876, LO Y876, LY Y876 LT Y87S - SmartLED LW L88C, LW L88S LB L89C, LB L89S, LG L890 LS L89K, LO L89K, LY L89K LS L896, LA L896, LO L896, LY L896 - TOPLED LS T670, LO T670, LY T670, LG T670, LP T670 LSG T670, LSP T670, LSY T670, LOP T670, LYG T670 LG T671, LOG T671, LSG T671 LB T673, LV T673, LT T673, LW T673 LH T674 LS T676, LA T676, LO T676, LY T676, LB T676, LH T676, LSB T676, LW T676 LB T67C, LV T67C, LT T67C, LS T67K, LO T67K, LY T67K, LW E67C LS E67B, LA E67B, LO E67B, LY E67B, LB E67C, LV E67C, LT E67C LW T67C LS T679, LY T679, LG T679 LS T770, LO T770, LY T770, LG T770, LP T770 LB T773, LV T773, LT T773, LW T773 LH T774 LS E675, LA E675, LY E675, LS T675 LS T776, LA T776, LO T776, LY T776, LB T776 LHGB T686 LT T68C, LB T68C - Hyper Mini TOPLED® LB M676 - Mini TOPLED Santana® LG M470 LS M47K, LO M47K, LY M47K Source: http://www.osram.convergy.de LUXEON: - LUMILED® LXK2-PW12-R00, LXK2-PW12-S00, LXK2-PW14-U00, LXK2-PW14-V00 LXK2-PM12-R00, LXK2-PM12-S00, LXK2-PM14-U00 LXK2-PE12-Q00, LXK2-PE12-R00, LXK2-PE12-S00, LXK2-PE14-T00, LXK2-PE14-U00 LXK2-PB12-K00, LXK2-PB12-L00, LXK2-PB12-M00, LXK2-PB14-N00, LXK2-PB14-P00, LXK2-PB14-Q00 LXK2-PR12-L00, LXK2-PR12-M00, LXK2-PR14-Q00, LXK2-PR14-R00 LXK2-PD12-Q00, LXK2-PD12-R00, LXK2-PD12-S00 LXK2-PH12-R00, LXK2-PH12-S00 LXK2-PL12-P00, LXK2-PL12-Q00, LXK2-PL12-R00 Source: www.luxeon.com KINGBRIGHT: KA-3528ASYC Source: www.kingbright.com
LEDDRV11-LEDDRV13 LEDDRV21-LEDDRV23 LEDDRV31-LEDDRV33 LEDDRV41-LEDDRV43 = TPS92511:TPS92511: 500-mA, 65-V Common Anode Constant Current Buck LED Driver Without External Current Sensing Resistor
Q2 = IRLML6402:IRLML6402: HEXFET P-Channel Power MOSFET
Q3 = transistor-fet:BSS138*: Power MOSFET
R1 R2 R7-R10 R13-R23 R25-R32 R35-R38 R41-R60 R63-R65 = rcl:R-EU_: RESISTOR, European symbol; SPICEPREFIX: R
R3-R6 R11 R12 R24 R33 R34 R39 R40 = rcl:R-EU_: RESISTOR, European symbol
SW1 = 500SSP1S1M6QEA:500SSP1S1M6QEA
TP1 TP2 = Testpoints:TP: KEYSTONE SURFACE MOUNT TEST POINTS
U1 = USBLC6-2:USBLC6-2: Very low capacitance ESD protection
U2 = TLV733P:TLV733*P?: TLV733P Capacitor-Free, 300-mA, Low-Dropout Regulator in 1-mm × 1-mm X2SON Package
U5 = TPS560200:TPS560200: 4.5-V to 17-V Input, 500-mA Synchronous Step-Down Converter With Advanced Eco-Mode
X1 = Molex 52610-XX72:52610-2072
X2 = PJ-002AH:PJ-002AH
X3 = con-subd:F09HP: SUB-D; OC_FARNELL: unknown; OC_NEWARK: unknown

## Net classes
2 Power: clearance 0.203 mm

## Board
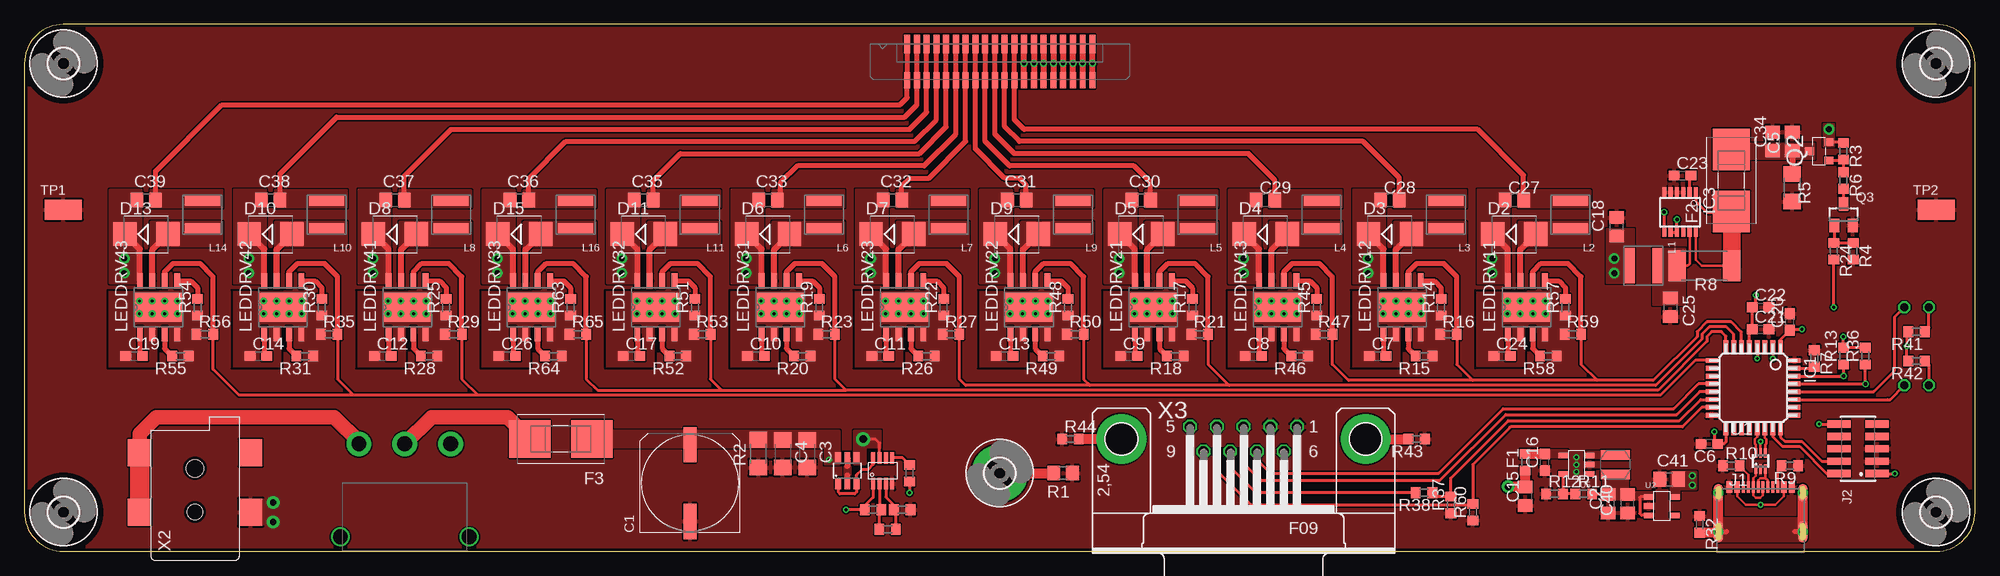
[diagram p6: board, top side]
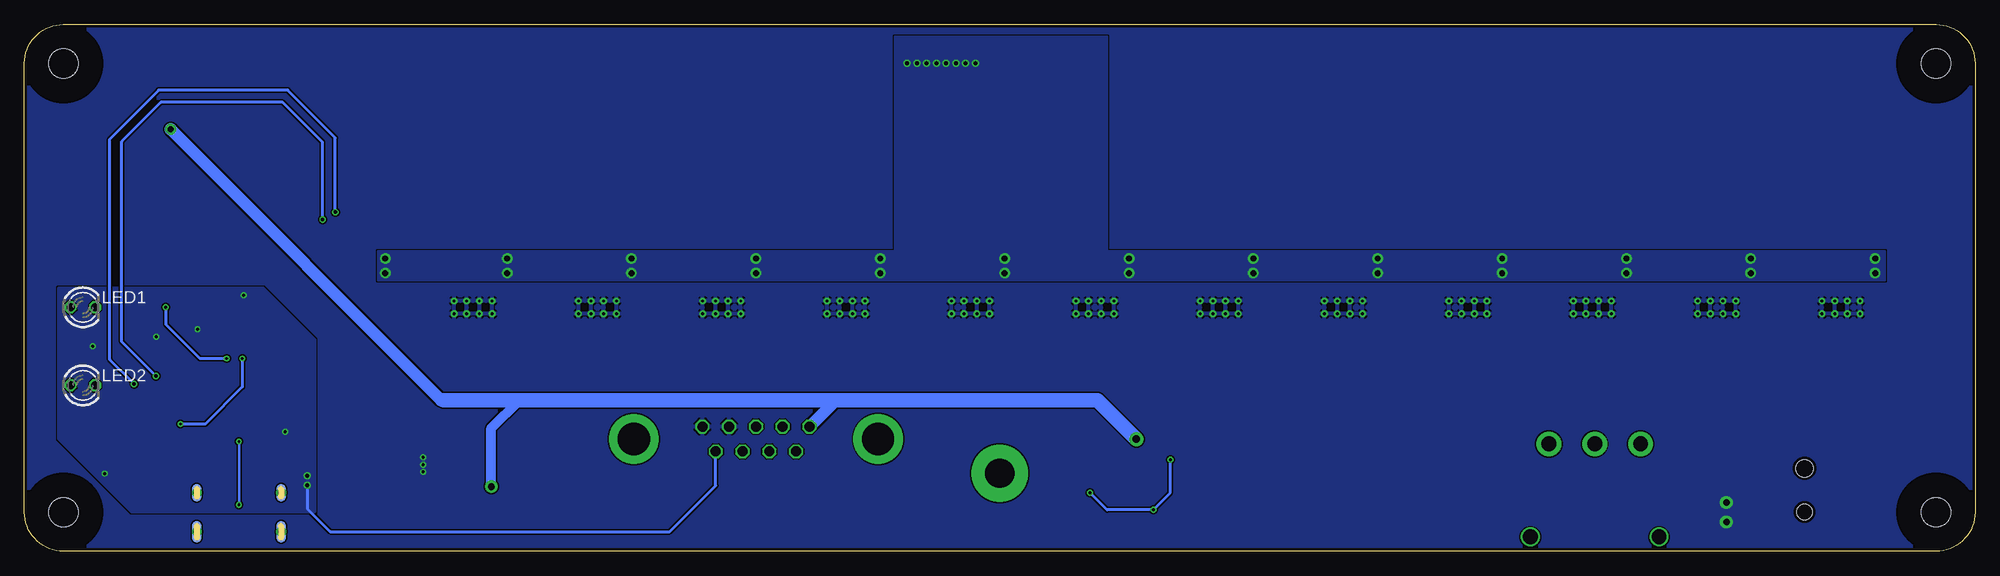
[diagram p7: board, bottom side, seen from below]

Size 200 x 54 mm. Coordinates in mm from the lower left corner, seen from the top.
Outline: 0,4 arc90 4,0 196,0 arc90 200,4 200,50 arc90 196,54 4,54 arc90 0,50 0,4
Copper layers (1*16): Top 0.035mm / dielectric 1.5mm / Bottom 0.035mm
Design rules "PCB-POOL Standard": minimum track width 0.15mm, minimum drill 0.3mm, track to track 0.15mm, track to pad 0.15mm, pad to pad 0.15mm, via to via 0.15mm, smd to smd 0.15mm, copper to edge 0.3mm, drill to drill 0.2mm, minimum pad ring 0.2mm, minimum via ring 0.15mm, stop-mask expansion 0.075mm, vias tented up to drill 0mil, thermal gap 0.2mm
tRestrict: 48 lines

### Footprints (pad centres in the part's own frame; a part is rotated, then mirrored left to right if it is on the bottom)
UD-10X10_NICHICON = smd 3.6 x 1.3: + 3.925,0; - -3.95,0
C0805 = smd 1.3 x 1.5: 1 -0.95,0; 2 0.95,0
C1206 = smd 1.6 x 1.8: 1 -1.4,0; 2 1.4,0
C0603 = smd 1.1 x 1: 1 -0.85,0; 2 0.85,0
SMB = smd 2.4 x 2.4: A 2.2,0; C -2.2,0
R0603 = smd 1 x 1.1: 1 -0.85,0; 2 0.85,0
NANO2_SMF_FUSEBLOCK = smd 4.24 x 3.81: 1 -3.19,0; 2 3.19,0
3,0-PAD = drill 3 pad 5.842: B3,0 0,0
3,0 = hole 3: 0,0
LQFP32 = smd 0.5 x 1.2: 1 -2.8,-4.25; 2 -2,-4.25; 3 -1.2,-4.25; 4 -0.4,-4.25; 5 0.4,-4.25; 6 1.2,-4.25; 7 2,-4.25; 8 2.8,-4.25; 17 2.8,4.25; 18 2,4.25; 19 1.2,4.25; 20 0.4,4.25; 21 -0.4,4.25; 22 -1.2,4.25; 23 -2,4.25; 24 -2.8,4.25 | smd 1.2 x 0.5: 9 4.25,-2.8; 10 4.25,-2; 11 4.25,-1.2; 12 4.25,-0.4; 13 4.25,0.4; 14 4.25,1.2; 15 4.25,2; 16 4.25,2.8; 25 -4.25,2.8; 26 -4.25,2; 27 -4.25,1.2; 28 -4.25,0.4; 29 -4.25,-0.4; 30 -4.25,-1.2; 31 -4.25,-2; 32 -4.25,-2.8
MSOP12 = smd 0.419 x 1.016: 1 -1.626,-2.032; 2 -0.975,-2.032; 3 -0.325,-2.032; 4 0.325,-2.032; 5 0.975,-2.032; 6 1.626,-2.032; 7 1.626,2.032; 8 0.975,2.032; 9 0.325,2.032; 10 -0.325,2.032; 11 -0.975,2.032; 12 -1.626,2.032
TSOT-23-8 = smd 1.22 x 0.4: 1 -1.31,0.975; 2 -1.31,0.325; 3 -1.31,-0.325; 4 -1.31,-0.975; 5 1.31,-0.975; 6 1.31,-0.325; 7 1.31,0.325; 8 1.31,0.975
TSOT-23-6 = smd 0.6 x 1.22: 1 -0.95,-1.31; 2 0,-1.31; 3 0.95,-1.31; 4 0.95,1.31; 5 0,1.31; 6 -0.95,1.31
2171790001_MOL = smd 0.6 x 1.15: A1/B12 -3.2,2.575; A4/B9 -2.4,2.575; B1/A12 3.2,2.575; B4/A9 2.4,2.575 | smd 0.3 x 1.15: A5 -1.25,2.575; A6 -0.25,2.575; A7 0.25,2.575; A8 1.25,2.575; B5 1.75,2.575; B6 0.75,2.575; B7 -0.75,2.575; B8 -1.75,2.575 | drill 0.6 pad 1: P1 -4.32,2; P2 4.32,2; P3 -4.32,-2; P4 4.32,-2 | smd 1 x 1.8: S1 -4.32,2; S2 4.32,2 | smd 1 x 2.2: S3 -4.32,-2; S4 4.32,-2 | smd 1 x 2.2 bottom: S5 -4.32,-2; S6 4.32,-2 | smd 1 x 1.8 bottom: S7 4.32,2; S8 -4.32,2
62101021021 = smd 0.75 x 2.4: 1 -2.54,-1.95; 2 -2.54,1.95; 3 -1.27,-1.95; 4 -1.27,1.95; 5 0,-1.95; 6 0,1.95; 7 1.27,-1.95; 8 1.27,1.95; 9 2.54,-1.95; 10 2.54,1.95
SMD = smd 3.6 x 1.1: 1 0,1.45; 2 0,-1.45
2SMD = smd 1 x 3: P$1 -1,0; P$2 1,0
LED3MM = drill 0.813 octagon: A -1.27,0; K 1.27,0
SOIC-8-EP = smd 1.55 x 0.6: 1 -2.7,1.905; 2 -2.7,0.635; 3 -2.7,-0.635; 4 -2.7,-1.905; 5 2.7,-1.905; 6 2.7,-0.635; 7 2.7,0.635; 8 2.7,1.905 | smd 2.95 x 4.9: EPAD 0,0 | drill 0.3 pad 0.6: P$1 -0.65,1.95; P$2 -0.65,0.65; P$3 -0.65,-0.65; P$4 -0.65,-1.95; P$5 0.65,-1.95; P$6 0.65,-0.65; P$7 0.65,0.65; P$8 0.65,1.95
MICRO3 = smd 0.8 x 0.9: 1 -0.95,-1; 2 0.95,-1; 3 0,1
SOT23 = smd 1 x 1.4: 1 -0.95,-1.1; 2 0.95,-1.1; 3 0,1.1
R0805 = smd 1.3 x 1.5: 1 -0.95,0; 2 0.95,0
R1206 = smd 1.6 x 1.803: 1 -1.422,0; 2 1.422,0
R2512 = smd 1.8 x 3.2: 1 -2.8,0; 2 2.8,0
500SSP1S1M6QEA = drill 1.524 pad 2.54: P1 -4.7,0; P2 0,0; P3 4.7,0 | drill 1.524: P4 -6.605,9.53; P5 6.605,9.53
3.8X2.03 = smd 3.8 x 2.03: TP 0,0
SOT-666 = smd 0.3 x 1: 1 -0.5,-0.81; 2 0,-0.81; 3 0.5,-0.81; 4 0.5,0.81; 5 0,0.81; 6 -0.5,0.81
SOT-23 = smd 0.55 x 1: 1 -0.95,-1.35; 2 0,-1.35; 3 0.95,-1.35; 4 0.95,1.35; 5 -0.95,1.35
52610-2072 = smd 0.6 x 1.9: 1-1 -9.5,0; 2-1 -8.5,0; 3-1 -7.5,0; 4-1 -6.5,0; 5-1 -5.5,0; 6-1 -4.5,0; 7-1 -3.5,0; 8-1 -2.5,0; 9-1 -1.5,0; 10-1 -0.5,0; 11-1 0.5,0; 12-1 1.5,0; 13-1 2.5,0; 14-1 3.5,0; 15-1 4.5,0; 16-1 5.5,0; 17-1 6.5,0; 18-1 7.5,0; 19-1 8.5,0; 20-1 9.5,0 | smd 0.6 x 1.65: 1-2 -9.5,-3.725; 2-2 -8.5,-3.725; 3-2 -7.5,-3.725; 4-2 -6.5,-3.725; 5-2 -5.5,-3.725; 6-2 -4.5,-3.725; 7-2 -3.5,-3.725; 8-2 -2.5,-3.725; 9-2 -1.5,-3.725; 10-2 -0.5,-3.725; 11-2 0.5,-3.725; 12-2 1.5,-3.725; 13-2 2.5,-3.725; 14-2 3.5,-3.725; 15-2 4.5,-3.725; 16-2 5.5,-3.725; 17-2 6.5,-3.725; 18-2 7.5,-3.725; 19-2 8.5,-3.725; 20-2 9.5,-3.725
PJ-002AH-SMT = smd 2.8 x 2.4: 1-1 5,5.7; 1-2 11.1,5.7; 2 5,-5.7; 3 11.1,-5.7 | hole 1.6: 5,0 | hole 1.8: 9.5,0
F09HP = drill 1.016 octagon: 1 -5.486,-1.27; 2 -2.743,-1.27; 3 0,-1.27; 4 2.743,-1.27; 5 5.486,-1.27; 6 -4.115,1.27; 7 -1.372,1.27; 8 1.372,1.27; 9 4.115,1.27 | drill 3.302 pad 5.08: G1 -12.522,0; G2 12.522,0

### Placement (x,y rotation side)
C1  68.25,7 90 top
C2  162.38,4.88 90 top
C3  80.25,10 270 top
C4  77.75,10 270 top
C5  181.25,42 90 top
C6  172.75,11 180 top
C7  138.75,20 0 top
C8  126,20 0 top
C9  113.25,20 0 top
C10  75,20 0 top
C11  87.75,20 0 top
C12  36.75,20 0 top
C13  100.5,20 0 top
C14  24,20 0 top
C15  153.88,5.62 90 top
C16  155.88,9.12 90 top
C17  62.25,20 0 top
C18  163.25,33.25 90 top
C19  11.25,20 0 top
C20  181,23.5 90 top
C21  178,22.75 0 top
C22  178,25 0 top
C23  170,38.5 0 top
C24  151.5,20 0 top
C25  168.75,25 270 top
C26  49.5,20 0 top
C27  152.75,36 0 top
C28  140,36 0 top
C29  127.25,36 0 top
C30  114.5,36 0 top
C31  101.75,36 0 top
C32  89,36 0 top
C33  76.25,36 0 top
C34  179.25,42 90 top
C35  63.5,36 0 top
C36  50.75,36 0 top
C37  38,36 0 top
C38  25.25,36 0 top
C39  12.5,36 0 top
C40  164.38,4.88 90 top
C41  168.62,7.38 0 top
D2  152.75,32.5 0 top
D3  140,32.5 0 top
D4  127.25,32.5 0 top
D5  114.5,32.5 0 top
D6  76.25,32.5 0 top
D7  89,32.5 0 top
D8  38,32.5 0 top
D9  101.75,32.5 0 top
D10  25.25,32.5 0 top
D11  63.5,32.5 0 top
D13  12.5,32.5 0 top
D15  50.75,32.5 0 top
F1  153.88,9.12 90 top
F2  175,38 90 top
F3  55,11.5 180 top
GROUNDING  100,8 0 top
H1  4,4 0 top
H2  196,4 0 top
H3  196,50 0 top
H4  4,50 0 top
IC1  177.25,16.75 180 top
IC3  169.75,34.75 180 top
IC5  88,8.25 90 top
IC6  84.38,8.25 0 top
J1  178,4 0 top
J2  188,10.5 90 top
L1  166,29.25 270 top
L2  158.5,34.5 180 top
L3  145.75,34.5 180 top
L4  133,34.5 180 top
L5  120.25,34.5 180 top
L6  82,34.5 180 top
L7  94.75,34.5 180 top
L8  43.75,34.5 180 top
L9  107.5,34.5 180 top
L10  31,34.5 180 top
L11  69.25,34.5 180 top
L13  163.12,8.88 270 top
L14  18.25,34.5 180 top
L16  56.5,34.5 180 top
LED1  194,25 0 bottom
LED2  194,17 0 bottom
LEDDRV11  154,25 90 top
LEDDRV12  141.25,25 90 top
LEDDRV13  128.5,25 90 top
LEDDRV21  115.75,25 90 top
LEDDRV22  103,25 90 top
LEDDRV23  90.25,25 90 top
LEDDRV31  77.5,25 90 top
LEDDRV32  64.75,25 90 top
LEDDRV33  52,25 90 top
LEDDRV41  39.25,25 90 top
LEDDRV42  26.5,25 90 top
LEDDRV43  13.75,25 90 top
Q2  184,41 90 top
Q3  186.5,34.5 0 top
R1  106.5,8 180 top
R2  75.25,10 90 top
R3  186.5,41 270 top
R4  187.5,30.75 270 top
R5  181.25,37.25 270 top
R6  186.5,38 270 top
R7  183.5,19.75 270 top
R8  172.25,29.25 180 top
R9  181,8.75 180 top
R10  175,8.75 0 top
R11  159.88,5.88 0 top
R12  156.88,5.88 0 top
R13  186.5,20 90 top
R14  145.25,25 90 top
R15  143.5,20 180 top
R16  146,22.25 0 top
R17  119.75,25 90 top
R18  118,20 180 top
R19  81.5,25 90 top
R20  79.75,20 180 top
R21  120.5,22.25 0 top
R22  94.25,25 90 top
R23  82.25,22.25 0 top
R24  185.5,30.75 270 top
R25  43.25,25 90 top
R26  92.5,20 180 top
R27  95,22.25 0 top
R28  41.5,20 180 top
R29  44,22.25 0 top
R30  30.5,25 90 top
R31  28.75,20 180 top
R32  171.75,2.75 270 top
R33  88.5,2.25 180 top
R34  90,4.25 180 top
R35  31.25,22.25 0 top
R36  188.75,20 90 top
R37  146.25,4.75 90 top
R38  143.5,6 180 top
R39  90.75,8 270 top
R40  87,4.25 180 top
R41  194,22.5 180 top
R42  194,19.5 180 top
R43  142.75,11.5 180 top
R44  107.25,11.5 0 top
R45  132.5,25 90 top
R46  130.75,20 180 top
R47  133.25,22.25 0 top
R48  107,25 90 top
R49  105.25,20 180 top
R50  107.75,22.25 0 top
R51  68.75,25 90 top
R52  67,20 180 top
R53  69.5,22.25 0 top
R54  17.75,25 90 top
R55  16,20 180 top
R56  18.5,22.25 0 top
R57  158,25 90 top
R58  156.25,20 180 top
R59  158.75,22.25 0 top
R60  148.5,4 90 top
R63  56,25 90 top
R64  54.25,20 180 top
R65  56.75,22.25 0 top
SW1  39,11 180 top
TP1  4,35 0 top
TP2  196,35 0 top
U1  178,9.25 0 top
U2  167.88,4.62 270 top
U5  159.12,8.88 90 top
X1  100,52 0 top
X2  17.5,-1 90 top
X3  125,11.5 180 top

### Tracks (layer width: path | path; a pad name or v marks a point on that pad's centre or on a via)
!NRST  (via drill 0.3)
  Top 0.305: IC1.4 v177.65,19.75 | v184,13.04 J2.10
  Bottom 0.305: v177.65,19.75 177.65,16.85 181.46,13.04 v184,13.04
+12V  (via drill 0.6, 0.7, 0.8)
  Top 0.305: Q2.2 186.5,41.95 R3.1 | IC5.7 87.67,11.07 87.25,11.5 v86,11.5
  Top 1.016: v152.12,6.62 153.8,6.62 C15.2 F1.1
  Bottom 1.016: 157.25,15.5 157,15.5 | v152.12,6.62 152.12,12.62 149.25,15.5
  Bottom 1.27: v185,43.25 157.25,15.5 | X3.5 116.78,15.5
  Bottom 1.5: v86,11.5 90,15.5 116.78,15.5 149.25,15.5 157,15.5
  pour Top (no thermals): 184.5,43.75 185.5,43.75 185.5,41.5 184.5,41.5
  pour Top (no thermals): 86.18,9 86.18,10.75 87.75,10.75 87.75,12.25 85.12,12.25 85.12,9
DIM1
  Top 0.305: IC1.6 176.05,22.45 175,23.5 172.5,23.5 171.5,22.5 171.5,22 167,17.5 161.25,17.5 | R47.2 134.1,19.15 135.75,17.5 148.5,17.5 | 161.25,17.5 148.5,17.5 | R16.2 146.85,19.15 148.5,17.5 | R59.2 159.6,19.15 161.25,17.5
  Top 0.508: LEDDRV11.6 154.63,28.64 155.5,29.5 158.25,29.5 159.6,28.15 R59.2 | LEDDRV12.6 141.88,28.64 142.75,29.5 145.5,29.5 146.85,28.15 R16.2 | LEDDRV13.6 129.13,28.64 130,29.5 132.75,29.5 134.1,28.15 R47.2
DIM2
  Top 0.305: IC1.7 175.25,22.25 174.5,23 172.75,23 172,22.25 172,21.75 167.25,17 123.5,17 | R27.2 95.85,17.65 96.5,17 109.25,17 | 123.5,17 109.25,17 | R50.2 108.6,17.65 109.25,17 | R21.2 121.35,19.15 123.5,17
  Top 0.508: LEDDRV21.6 116.39,28.64 117.25,29.5 120,29.5 121.35,28.15 R21.2 | LEDDRV22.6 103.64,28.64 104.5,29.5 107.25,29.5 108.6,28.15 R50.2 | LEDDRV23.6 90.89,28.64 91.75,29.5 94.5,29.5 95.85,28.15 R27.2
DIM3
  Top 0.305: IC1.8 174.45,22.05 174,22.5 173,22.5 172.5,22 172.5,21.5 167.5,16.5 84.25,16.5 | R23.2 83.1,17.65 84.25,16.5 | R65.2 57.6,17.65 58.75,16.5 71.5,16.5 | 71.5,16.5 84.25,16.5 | R53.2 70.35,17.65 71.5,16.5
  Top 0.508: LEDDRV31.6 78.14,28.64 79,29.5 81.75,29.5 83.1,28.15 R23.2 | LEDDRV32.6 65.39,28.64 66.25,29.5 69,29.5 70.35,28.15 R53.2 | LEDDRV33.6 52.63,28.64 53.5,29.5 56.25,29.5 57.6,28.15 R65.2
DIM4
  Top 0.305: IC1.9 171.3,19.55 167.75,16 46.5,16 | R56.2 19.35,18.65 22,16 33.75,16 | 46.5,16 33.75,16 | R35.2 32.1,17.65 33.75,16 | R29.2 44.85,17.65 46.5,16
  Top 0.508: LEDDRV41.6 39.88,28.64 40.75,29.5 43.5,29.5 44.85,28.15 R29.2 | LEDDRV42.6 27.14,28.64 28,29.5 30.75,29.5 32.1,28.15 R35.2 | LEDDRV43.6 14.38,28.64 15.25,29.5 18,29.5 19.35,28.15 R56.2
FEEDBACK_ISO
  Top 0.305: IC1.15 172,14.75 170,12.75 152.38,12.75 152.25,12.62 148.5,8.88 R60.2 148.4,4.75 125.75,4.75 122.26,8.24 X3.4
FEEDBACK_TTL
  Top 0.305: IC1.14 171.88,15.55 169.7,13.38 152.12,13.38 146.25,7.5 R37.2 144.75,5.6 R38.1 144.72,5.62
GND  (via drill 0.3, 0.65 pad 1.3)
  other vias: 25.5,5 25.5,3 159.12,9.62 159.12,8.88 159.12,8.12
  pour Top (rank 2): 0,50 arc-90 4,54 196,54 arc-90 200,50 200,4 arc-90 196,0 4,0 arc-90 0,4
  pour Top (no thermals): 153.5,19 153.5,26.5 149,26.5 149,19
  pour Top (no thermals): 154.5,19 154.5,30.25 160.5,30.25 160.5,19
  pour Top (no thermals): 140.75,19 140.75,26.5 136.25,26.5 136.25,19
  pour Top (no thermals): 141.75,19 141.75,30.25 147.75,30.25 147.75,19
  pour Top (no thermals): 128,19 128,26.5 123.5,26.5 123.5,19
  pour Top (no thermals): 129,19 129,30.25 135,30.25 135,19
  pour Top (no thermals): 115.25,19 115.25,26.5 110.75,26.5 110.75,19
  pour Top (no thermals): 116.25,19 116.25,30.25 122.25,30.25 122.25,19
  pour Top (no thermals): 102.5,19 102.5,26.5 98,26.5 98,19
  pour Top (no thermals): 103.5,19 103.5,30.25 109.5,30.25 109.5,19
  pour Top (no thermals): 89.75,19 89.75,26.5 85.25,26.5 85.25,19
  pour Top (no thermals): 90.75,19 90.75,30.25 96.75,30.25 96.75,19
  pour Top (no thermals): 77,19 77,26.5 72.5,26.5 72.5,19
  pour Top (no thermals): 78,19 78,30.25 84,30.25 84,19
  pour Top (no thermals): 64.25,19 64.25,26.5 59.75,26.5 59.75,19
  pour Top (no thermals): 65.25,19 65.25,30.25 71.25,30.25 71.25,19
  pour Top (no thermals): 51.5,19 51.5,26.5 47,26.5 47,19
  pour Top (no thermals): 52.5,19 52.5,30.25 58.5,30.25 58.5,19
  pour Top (no thermals): 38.75,19 38.75,26.5 34.25,26.5 34.25,19
  pour Top (no thermals): 39.75,19 39.75,30.25 45.75,30.25 45.75,19
  pour Top (no thermals): 26,19 26,26.5 21.5,26.5 21.5,19
  pour Top (no thermals): 27,19 27,30.25 33,30.25 33,19
  pour Top (no thermals): 13.25,19 13.25,26.5 8.75,26.5 8.75,19
  pour Top (no thermals): 14.25,19 14.25,30.25 20.25,30.25 20.25,19
  pour Bottom (rank 2): 0,50 arc-90 4,54 196,54 arc-90 200,50 200,4 arc-90 196,0 4,0 arc-90 0,4
  pour Top (no thermals): 22.5,5 25.5,5 25.5,3 22.5,3
  pour Top (no thermals): 158.62,10.38 159.62,10.38 159.62,9.12 161.25,9.12 161.25,8.62 159.62,8.62 159.62,7.38 158.62,7.38 158.62,8.62 157.12,8.62 157.12,9.12 158.62,9.12
  pour Top (no thermals): 167.75,37.5 168.25,37.5 168.25,36 167.75,36
  pour Top (no thermals): 178.12,8.62 178.12,9 179,9 179,9.5 177,9.5 177,9 177.88,9 177.88,8.62
  pour Top (no thermals): 166.12,4.88 167.75,4.88 167.75,4.38 166.12,4.38
LED11_IN
  Top 0.508: X1.12-1 X1.12-2 101.5,44.25 102.5,43.25 149,43.25 153.7,38.55 C27.2
  pour Top (no thermals): 153.25,37 160.5,37 160.5,35.25 153.25,35.25
LED12_IN
  Top 0.508: X1.11-1 X1.11-2 100.5,43.5 102,42 137.25,42 140.95,38.3 C28.2
  pour Top (no thermals): 140.5,35.25 140.5,37 147.75,37 147.75,35.25
LED13_IN
  Top 0.508: X1.10-1 X1.10-2 99.5,42.75 101.5,40.75 125.5,40.75 128.2,38.05 C29.2
  pour Top (no thermals): 127.75,35.25 127.75,37 135,37 135,35.25
LED21_IN
  Top 0.508: X1.9-1 X1.9-2 98.5,42 101,39.5 113.75,39.5 115.45,37.8 C30.2
  pour Top (no thermals): 115,35.25 115,37 122.25,37 122.25,35.25
LED22_IN
  Top 0.508: X1.8-1 X1.8-2 97.5,41.25 100.5,38.25 102,38.25 102.7,37.55 C31.2
  pour Top (no thermals): 102.25,35.25 102.25,37 109.5,37 109.5,35.25
LED23_IN
  Top 0.508: X1.7-1 X1.7-2 96.5,42 92.75,38.25 90.75,38.25 89.95,37.45 C32.2
  pour Top (no thermals): 89.5,35.25 89.5,37 96.75,37 96.75,35.25
LED31_IN
  Top 0.508: X1.6-1 X1.6-2 95.5,42.75 92.25,39.5 79.25,39.5 77.5,37.75 77.5,36.55 77.2,36.25 C33.2
  pour Top (no thermals): 76.75,35.25 76.75,37 84,37 84,35.25
LED32_IN
  Top 0.508: X1.5-1 X1.5-2 94.5,43.5 91.75,40.75 67.25,40.75 64.45,37.95 C35.2
  pour Top (no thermals): 64,35.25 64,37 71.25,37 71.25,35.25
LED33_IN
  Top 0.508: X1.4-1 X1.4-2 93.5,44.25 91.25,42 55.5,42 51.7,38.2 C36.2
  pour Top (no thermals): 51.25,35.25 51.25,37 58.5,37 58.5,35.25
LED41_IN
  Top 0.508: X1.3-1 X1.3-2 92.5,45 90.75,43.25 43.75,43.25 38.95,38.45 C37.2
  pour Top (no thermals): 38.5,35.25 38.5,37 45.75,37 45.75,35.25
LED42_IN
  Top 0.508: X1.2-1 X1.2-2 91.5,45.75 90.25,44.5 32,44.5 26.2,38.7 C38.2
  pour Top (no thermals): 25.75,35.25 25.75,37 33,37 33,35.25
LED43_IN
  Top 0.508: X1.1-1 X1.1-2 90.5,46.5 89.75,45.75 20.25,45.75 13.45,38.95 C39.2
  pour Top (no thermals): 13,35.25 13,37 20.25,37 20.25,35.25
LED_ENABLE  (via drill 0.3)
  Top 0.305: IC1.2 v179.25,19.75 | v185.5,25 R24.2
  Bottom 0.305: v179.25,19.75 182,19.75 185.5,23.25 v185.5,25
LED_PWR  (via drill 0.4, 0.6)
  Top 0.61: LEDDRV11.8 152.09,30.95 D2.C | LEDDRV12.8 139.34,30.95 D3.C | LEDDRV13.8 126.59,30.95 D4.C | LEDDRV21.8 113.84,30.95 D5.C | LEDDRV22.8 101.09,30.95 D9.C | LEDDRV23.8 88.34,30.95 D7.C | LEDDRV31.8 75.59,30.95 D6.C | LEDDRV32.8 62.84,30.95 D11.C | LEDDRV33.8 50.09,30.95 D15.C | LEDDRV41.8 37.34,30.95 D8.C | LEDDRV42.8 24.59,30.95 D10.C | LEDDRV43.8 11.85,30.95 D13.C | X1.17-1 v106.5,50 X1.17-2 | X1.18-2 v107.5,50 X1.18-1 | X1.19-1 v108.5,50 X1.19-2 | X1.20-2 v109.5,50 X1.20-1 | X1.13-2 v102.5,50 X1.13-1 | X1.14-1 v103.5,50 X1.14-2 | X1.15-1 v104.5,50 X1.15-2 | X1.16-1 v105.5,50 X1.16-2
  other vias: 163,30 163,28.5 10.25,30 10.25,28.5 23,30 23,28.5 35.75,30 35.75,28.5 48.5,30 48.5,28.5 61.25,30 61.25,28.5 74,30 74,28.5 86.75,30 86.75,28.5 99.5,30 99.5,28.5 112.25,30 112.25,28.5 125,30 125,28.5 137.75,30 137.75,28.5 150.5,30 150.5,28.5
  pour Top (no thermals): 152.25,27.5 152.25,37 149,37 149,27.5
  pour Top (no thermals): 139.5,27.5 139.5,37 136.25,37 136.25,27.5
  pour Top (no thermals): 126.75,27.5 126.75,37 123.5,37 123.5,27.5
  pour Top (no thermals): 114,27.5 114,37 110.75,37 110.75,27.5
  pour Top (no thermals): 101.25,27.5 101.25,37 98,37 98,27.5
  pour Top (no thermals): 88.5,27.5 88.5,37 85.25,37 85.25,27.5
  pour Top (no thermals): 75.75,27.5 75.75,37 72.5,37 72.5,27.5
  pour Top (no thermals): 63,27.5 63,37 59.75,37 59.75,27.5
  pour Top (no thermals): 50.25,27.5 50.25,37 47,37 47,27.5
  pour Top (no thermals): 37.5,27.5 37.5,37 34.25,37 34.25,27.5
  pour Top (no thermals): 24.75,27.5 24.75,37 21.5,37 21.5,27.5
  pour Top (no thermals): 12,27.5 12,37 8.75,37 8.75,27.5
  pour Top (no thermals): 165,33 165,27.5 162.25,27.5 162.25,33
  pour Bottom: 163.75,30.75 163.75,27.75 9.25,27.75 9.25,30.75 89,30.75 89,52.75 110.75,52.75 110.75,30.75
N$1
  Top 1.016: GROUNDING.B3,0 R1.2
N$2
  Top 0.305: U2.3 165.82,3.67 165.62,3.88 165.62,5.5 165.7,5.58 U2.1 | R11.2 162.32,5.88 C2.2
  pour Top (no thermals): 161.88,8.12 161.88,5.38 167,5.38 167,6 164.38,6 164.38,8.12
N$3
  Top 0.254: IC3.11 170.72,29.48 170.5,29.25 R8.2
  pour Top (no thermals): 170.25,31 167,31 167,25.25 170.25,25.25
N$4
  Top 1.016: F1.2 C16.2
  pour Top (no thermals): 155.62,10.38 158.12,10.38 158.12,9.62 155.62,9.62
N$5
  Top 0.305: Q2.1 186.4,40.05 R3.2 R6.1
N$6
  Top 0.305: Q3.1 185.55,31.65 R24.1 R4.1
N$7
  Top 0.305: R6.2 Q3.3
N$8
  Top 0.61: C5.1 R5.1
  pour Top (no thermals): 183.5,41.75 175,41.75 175,40.25 183.5,40.25
N$9
  Top 0.305: IC1.31 183.35,18.75 R7.2
N$10
  Top 1.016: X3.G1 R43.2
N$11
  Top 1.5: SW1.P3 34.3,11.2 31.75,13.75 13.5,13.75 11.8,12.05 X2.1-2
  Top 2: X2.1-1 X2.1-2
N$12
  pour Top (no thermals): 160.12,9.62 164.38,9.62 164.38,10.12 160.12,10.12
N$13
  Top 0.254: U1.1 177.5,7.75 177.25,7.5 J1.B7 177.25,5.75 177.5,5.5 178,5.5 178.25,5.75 J1.A7
N$14  (via drill 0.3)
  Top 0.305: R39.2 v90.75,6 | v84.25,4.25 R40.2 86.15,4.65 87.03,5.53 IC5.1
  Bottom 0.305: v90.75,6 89,4.25 v84.25,4.25 82.5,6 v82.5,9.38
  pour Top (no thermals): 83.5,9 83.5,12.25 57.25,12.25 57.25,10.75 82.12,10.75 82.12,9
N$15
  Top 0.305: R11.1 R12.2 157.72,7.88 U5.5
N$16
  Top 0.254: J1.A6 177.75,7.25 178,7.5 178.5,7.5 | J1.B6 178.75,7.25 178.5,7.5 | U1.3 178.5,7.5
N$17
  Top 0.254: J1.B5 179.75,8.35 R9.2
N$18
  Top 0.254: J1.A5 176.75,7.85 R10.2
N$19
  Top 0.508: J1.P3 174.5,2 | J1.P4 181.5,2
  Top 1: J1.P1 J1.P3 173.58,1.9 R32.2 | J1.P4 J1.P2
  pour Top (no thermals): 173.68,3 182.32,3 182.32,1.4 173.68,1.4
N$20
  Top 0.254: R8.1 172,29.25 171.38,29.87 IC3.12
  Top 0.305: IC3.1 171.38,35.87 172.49,34.76 175.05,34.76
  Top 1.27: 175.05,34.76 F2.1
  Top 1.8: R8.1 175.05,34.76
N$21
  Top 0.61: LEDDRV12.7 140.62,30.91 D3.A
  pour Top (no thermals): 140.5,28 140.5,33.75 147.75,33.75 147.75,31.25 140.75,31.25 140.75,28
N$22
  Top 0.508: LEDDRV12.5 144.55,27.7 145.25,27 R14.2
N$23
  Top 0.508: LEDDRV12.3 141.88,20.77 R15.2
N$24
  Top 0.508: LEDDRV12.1 139.34,20.25 C7.2
N$25
  Top 0.61: LEDDRV13.7 127.86,30.91 D4.A
  pour Top (no thermals): 127.75,28 127.75,33.75 135,33.75 135,31.25 128,31.25 128,28
N$26
  Top 0.508: LEDDRV13.5 131.8,27.7 132.5,27 R45.2
N$27
  Top 0.508: LEDDRV13.3 129.13,20.77 R46.2
N$28
  Top 0.508: LEDDRV13.1 126.59,20.25 C8.2
N$29
  Top 0.61: LEDDRV21.7 115.11,30.91 D5.A
  pour Top (no thermals): 115,28 115,33.75 122.25,33.75 122.25,31.25 115.25,31.25 115.25,28
N$30
  Top 0.508: LEDDRV21.5 119.05,27.7 119.75,27 R17.2
N$31
  Top 0.508: LEDDRV21.3 116.39,20.77 R18.2
N$32
  Top 0.508: LEDDRV21.1 113.84,20.25 C9.2
N$33
  Top 0.61: LEDDRV31.7 76.86,30.91 D6.A
  pour Top (no thermals): 76.75,28 76.75,33.75 84,33.75 84,31.25 77,31.25 77,28
N$34
  Top 0.508: LEDDRV31.5 80.8,27.7 81.5,27 R19.2
N$35
  Top 0.508: LEDDRV31.3 78.14,20.77 R20.2
N$36
  Top 0.508: LEDDRV31.1 75.59,20.25 C10.2
N$37
  Top 0.61: LEDDRV23.7 89.61,30.91 D7.A
  pour Top (no thermals): 89.5,28 89.5,33.75 96.75,33.75 96.75,31.25 89.75,31.25 89.75,28
N$38
  Top 0.508: LEDDRV23.5 93.55,27.7 94.25,27 R22.2
N$39
  Top 0.508: LEDDRV23.3 90.89,20.77 R26.2
N$40
  Top 0.508: LEDDRV23.1 88.34,20.25 C11.2
N$41
  Top 0.61: LEDDRV41.7 38.62,30.91 D8.A
  pour Top (no thermals): 38.5,28 38.5,33.75 45.75,33.75 45.75,31.25 38.75,31.25 38.75,28
N$42
  Top 0.508: LEDDRV41.5 42.55,27.7 43.25,27 R25.2
N$43
  Top 0.508: LEDDRV41.3 39.88,20.77 R28.2
N$44
  Top 0.508: LEDDRV41.1 37.34,20.25 C12.2
N$45
  Top 0.61: LEDDRV22.7 102.36,30.91 D9.A
  pour Top (no thermals): 102.25,28 102.25,33.75 109.5,33.75 109.5,31.25 102.5,31.25 102.5,28
N$46
  Top 0.508: LEDDRV22.5 106.3,27.7 107,27 R48.2
N$47
  Top 0.508: LEDDRV22.3 103.64,20.77 R49.2
N$48
  Top 0.508: LEDDRV22.1 101.09,20.25 C13.2
N$49
  Top 0.61: LEDDRV42.7 25.86,30.91 D10.A
  pour Top (no thermals): 25.75,28 25.75,33.75 33,33.75 33,31.25 26,31.25 26,28
N$50
  Top 0.508: LEDDRV42.5 29.8,27.7 30.5,27 R30.2
N$51
  Top 0.508: LEDDRV42.3 27.14,20.77 R31.2
N$52
  Top 0.508: LEDDRV42.1 24.59,20.25 C14.2
N$53
  Top 0.61: LEDDRV32.7 64.11,30.91 D11.A
  pour Top (no thermals): 64,28 64,33.75 71.25,33.75 71.25,31.25 64.25,31.25 64.25,28
N$54
  Top 0.508: LEDDRV32.5 68.05,27.7 68.75,27 R51.2
N$55
  Top 0.508: LEDDRV32.3 65.39,20.77 R52.2
N$56
  Top 0.508: LEDDRV32.1 62.84,20.25 C17.2
N$57
  Top 1.5: SW1.P2 41.75,13.75 49.56,13.75 F3.2
N$58
  Top 0.305: R38.2 126.25,6 123.63,8.62 X3.8
N$61
  Top 0.61: LEDDRV43.7 13.12,30.91 D13.A
  pour Top (no thermals): 13,28 13,33.75 20.25,33.75 20.25,31.25 13.25,31.25 13.25,28
N$62
  Top 0.508: LEDDRV43.5 17.05,27.7 17.75,27 R54.2
N$63
  Top 0.508: LEDDRV43.3 14.38,20.77 R55.2
N$64
  Top 0.508: LEDDRV43.1 11.85,20.25 C19.2
N$65
  Top 0.305: IC6.1 83.42,6.08 83.62,5.88 85.12,5.88 85.33,6.08 IC6.3 85.33,7.83 85.88,8.38 86.5,8.38 87.03,8.9 IC5.8
N$66
  Top 0.305: R33.1 89.35,4.05 R34.2 89.15,4.72 88.33,5.55 IC5.3
N$67
  Top 0.305: R33.2 87.65,4.05 R40.1 87.67,4.42 IC5.2
N$68
  Top 0.305: R39.1 90.04,9.56 IC5.5
N$69
  Top 0.61: IC6.2 84.38,7.75 | IC6.5 84.38,8.75
  pour Top: 84.12,8.75 84.38,9.25 84.62,8.75 84.62,7.75 84.38,7.25 84.12,7.75
N$70
  Top 0.305: R41.1 195.27,22.92 LED1.A
N$71
  Top 0.305: R42.1 195.27,19.08 LED2.A
N$72
  Top 0.305: IC3.2 170.72,38.38 C23.2
N$73
  Top 1.016: X3.G2 R44.2
N$74
  Top 0.61: LEDDRV11.7 153.37,30.91 D2.A
  pour Top (no thermals): 153.25,28 153.25,33.75 160.5,33.75 160.5,31.25 153.5,31.25 153.5,28
N$75
  Top 0.508: LEDDRV11.5 157.3,27.7 158,27 R57.2
N$76
  Top 0.508: LEDDRV11.3 154.63,20.77 R58.2
N$77
  Top 0.508: LEDDRV11.1 152.09,20.25 C24.2
N$82
  Top 0.61: LEDDRV33.7 51.37,30.91 D15.A
  pour Top (no thermals): 51.25,28 51.25,33.75 58.5,33.75 58.5,31.25 51.5,31.25 51.5,28
N$83
  Top 0.508: LEDDRV33.5 55.3,27.7 56,27 R63.2
N$84
  Top 0.508: LEDDRV33.3 52.63,20.77 R64.2
N$85
  Top 0.508: LEDDRV33.1 50.09,20.25 C26.2
SCL  (via drill 0.35)
  Top 0.305: IC3.7 v168.12,34.75 | IC1.29 v188.75,17.15 R36.1
  Bottom 0.305: v168.12,34.75 168.12,42.37 173,47.25 186.25,47.25 191.25,42.25 191.25,19.65 v188.75,17.15
SDA  (via drill 0.35)
  Top 0.305: IC3.8 IC3.9 v169.43,34 | IC1.30 v186.5,17.95 R13.1
  Bottom 0.305: v169.43,34 169.43,41.92 173.5,46 186,46 190,42 190,21.45 v186.5,17.95
STATUS_BAD
  Top 0.305: IC1.28 189.6,16.35 191.75,18.5 191.75,24.02 LED1.K
STATUS_GOOD
  Top 0.305: IC1.27 191,15.55 191.28,15.55 LED2.K
SWCLK
  Top 0.305: IC1.24 180.05,11.7 180.5,11.25 182.25,11.25 184.27,9.23 J2.4
SWDIO
  Top 0.305: IC1.23 179.25,11.75 180.25,10.75 182,10.75 184.79,7.96 J2.2
TRIGGER_ISO
  Top 0.305: IC1.13 171.75,16.35 169.4,14 151.88,14 145.12,7.25 126.75,7.25 125,9 X3.3
TRIGGER_TTL
  Top 0.305: IC1.12 171.62,17.15 169.1,14.62 151.62,14.62 145,8 127.75,8 126.37,9.38 X3.7
USB_DM
  Top 0.254: IC1.21 177.65,11.72 177.42,11.49 177.42,11.01 177.5,10.93 U1.6
USB_DP
  Top 0.254: IC1.22 178.45,11.62 178.58,11.49 178.58,11.01 178.5,10.93 U1.4
VBUS  (via drill 0.3)
  Top 0.254: U1.5 v178,11.25 | J1.A4/B9 175.6,5.65 176.5,4.75 v178,4.75 179.5,4.75 180.4,5.65 J1.B4/A9
  Bottom 0.254: v178,4.75 v178,11.25
VCC  (via drill 0.3, 0.4)
  Top 0.305: IC1.17 174.45,11.2 174.25,11 C6.1 173.25,11.35 v173.25,12.25 | IC1.5 176.85,22.45 C21.1 C22.1 177.5,25.35 v177.5,26.25 | IC1.1 180.05,21.7 C20.1 181.1,22.75 v182.25,22.75 | R36.2 R13.2 v186.5,22 | R42.2 193,19.65 v193,21 193,22.35 R41.2 | J2.1 v191.75,7.96
  Bottom 0.305: X3.6 129.12,6.73 133.84,2 168.62,2 171,4.38 v171,6.75
  other vias: 171,7.75
  pour Bottom: 170.25,4 189,4 196.5,11.5 196.5,27 175.5,27 170.25,21.75
  pour Top (no thermals): 168.88,5.38 168.88,8.12 171.38,8.12 171.38,6.38 169.62,6.38 169.62,5.38

### Text on the board
tStop: Hochschule / Bonn-Rhein-Sieg | Institut für / Sicherheitsforschung | 1
bStop: Marcel Hasler, 2021 | SkinCam: / Controller 2.0